# EAGLE board AnodV2.1 (EAGLE 5.11), part 1 of 3
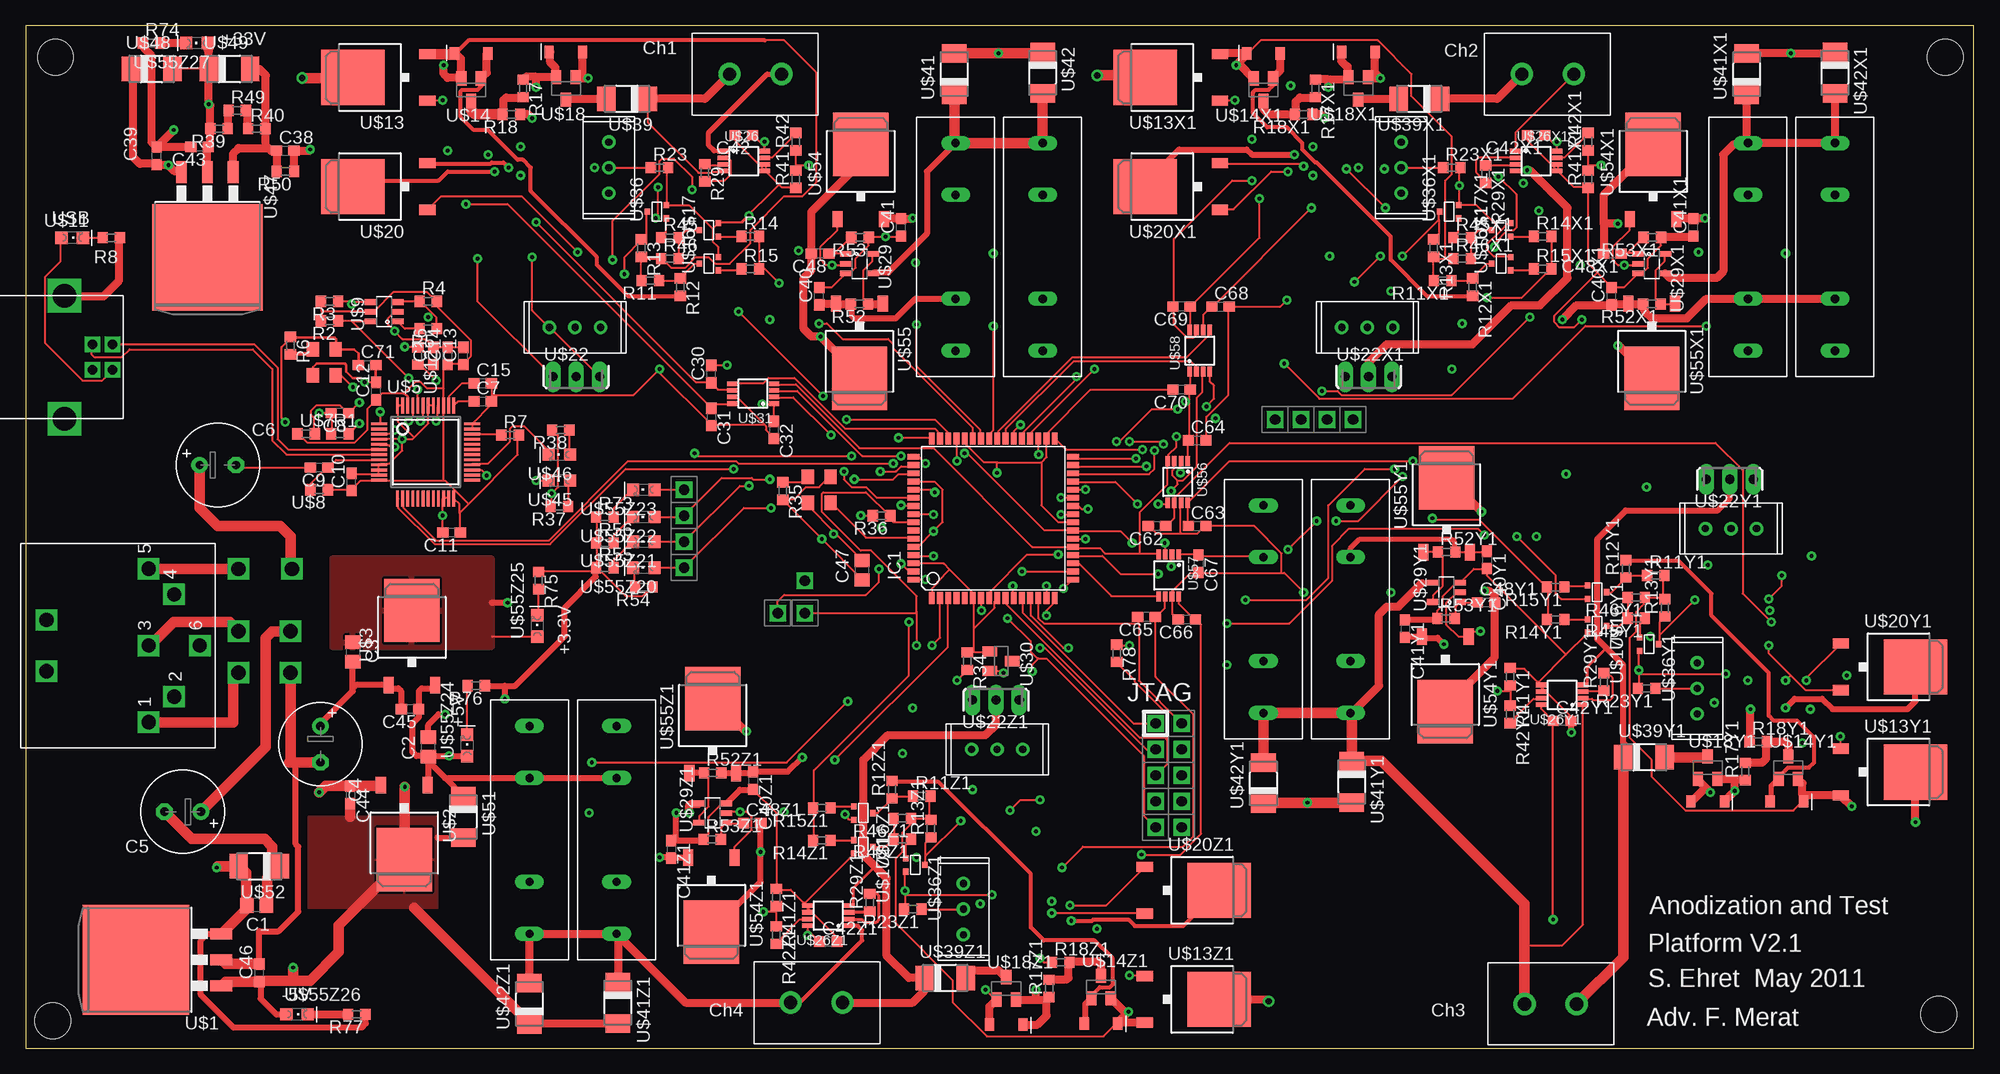
[diagram p6: board, top side]
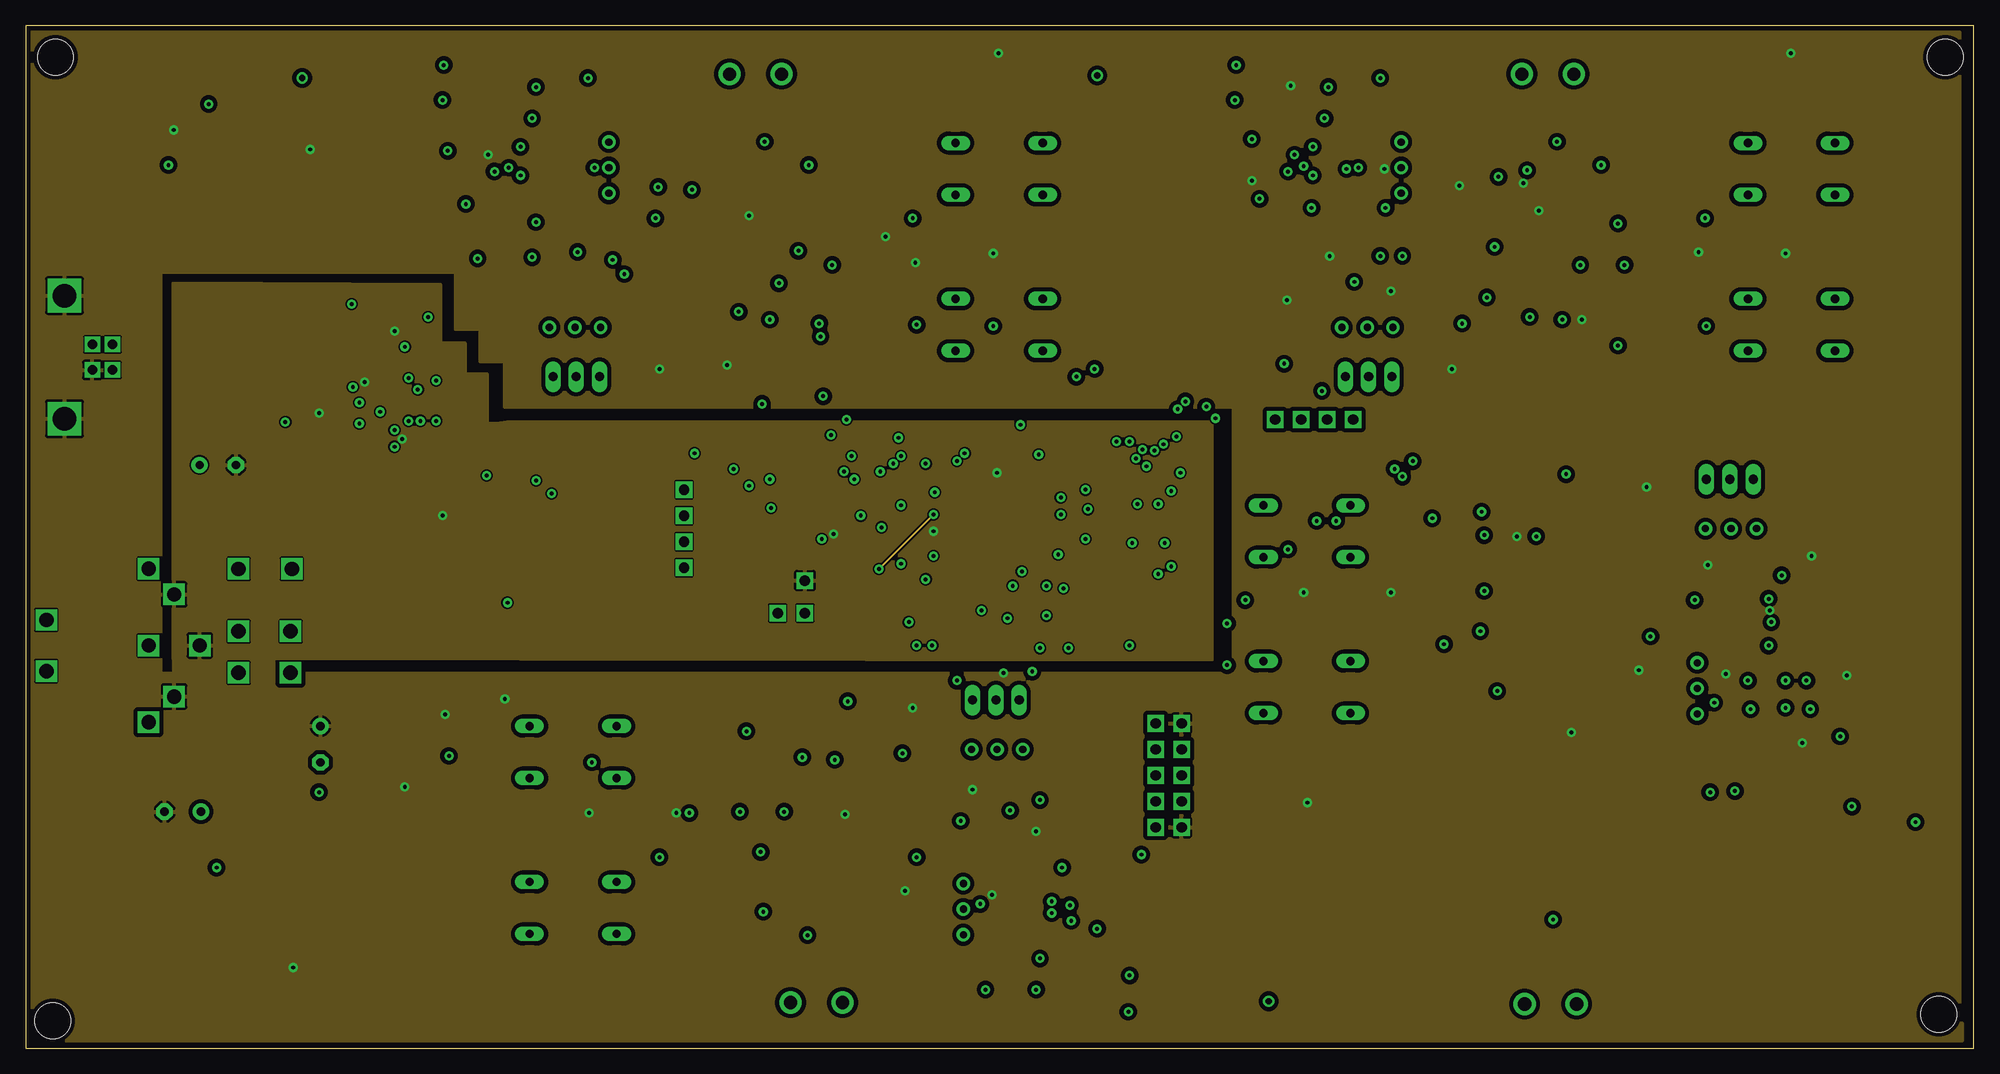
[diagram p7: board, inner layer Route2]
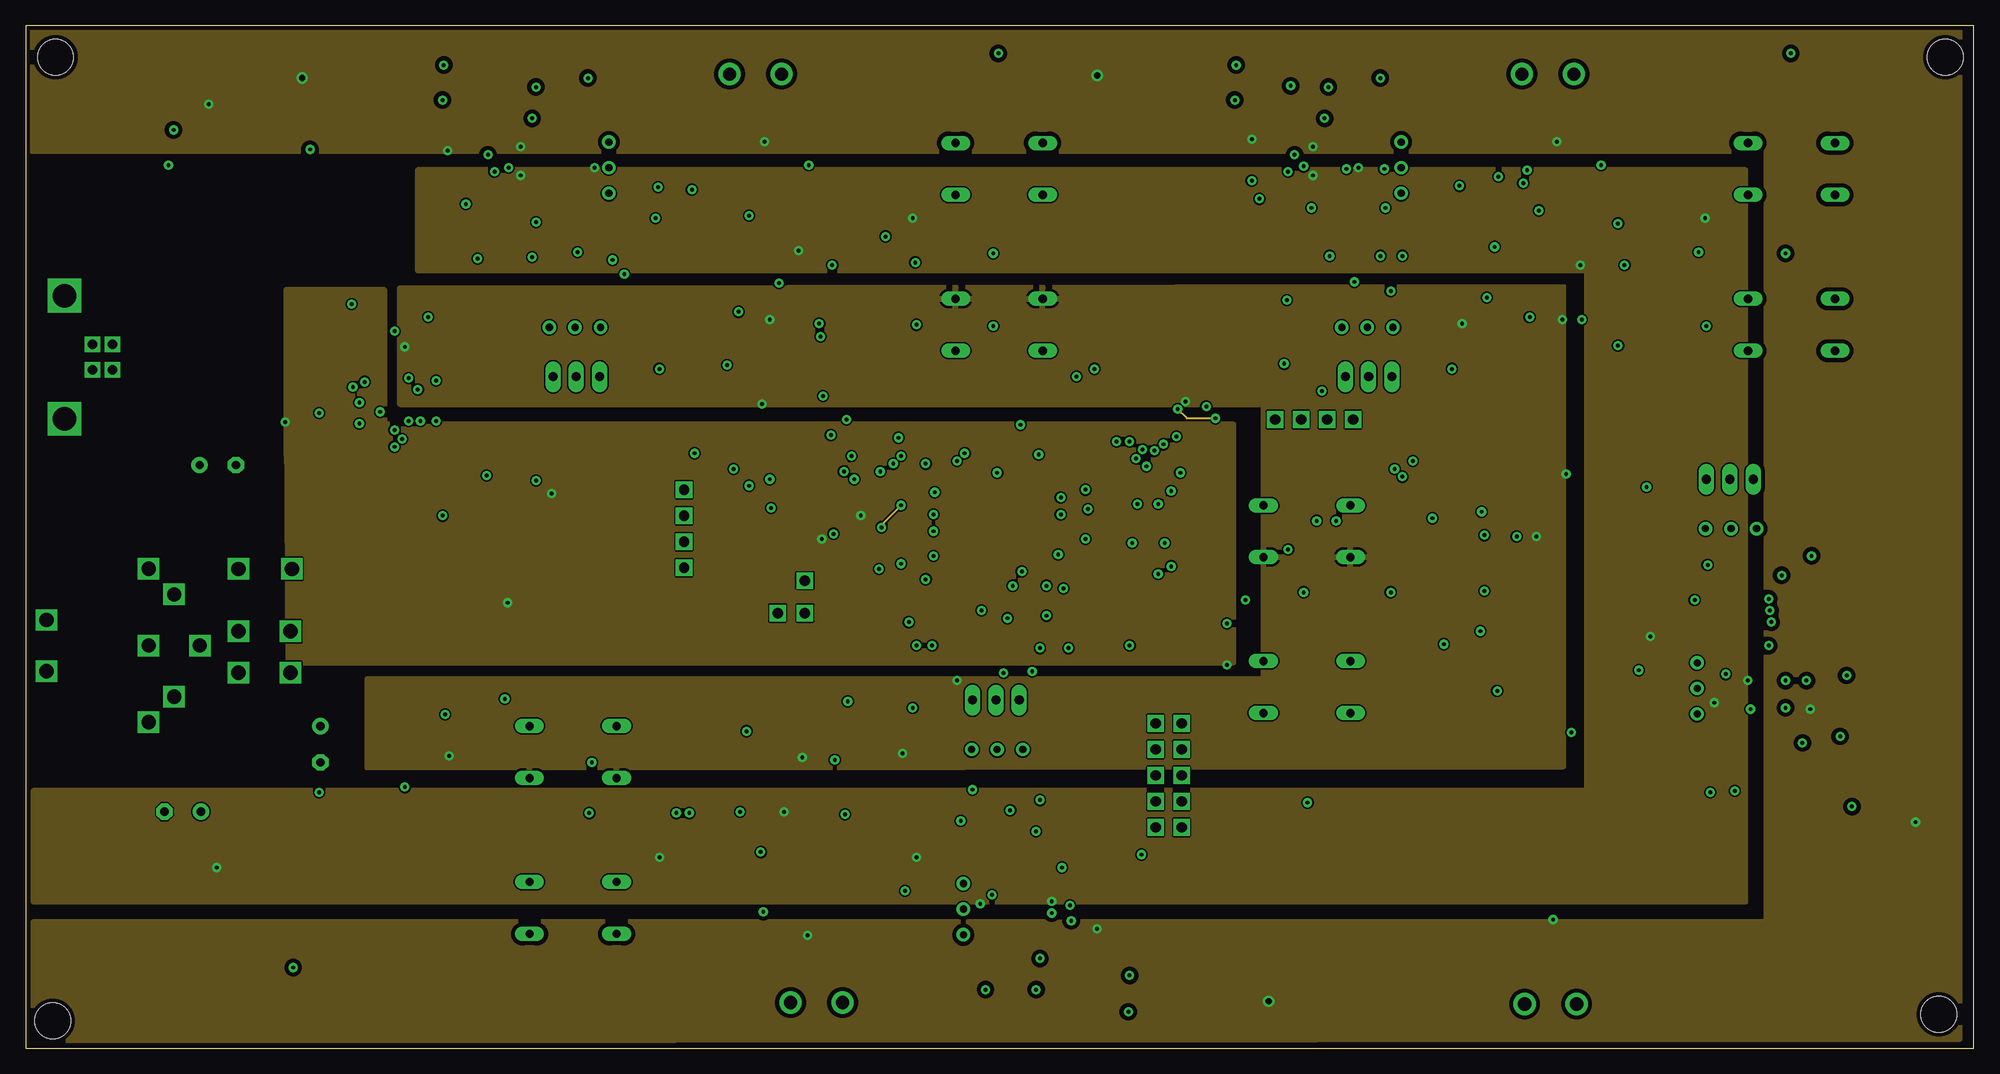
[diagram p8: board, inner layer Route15]
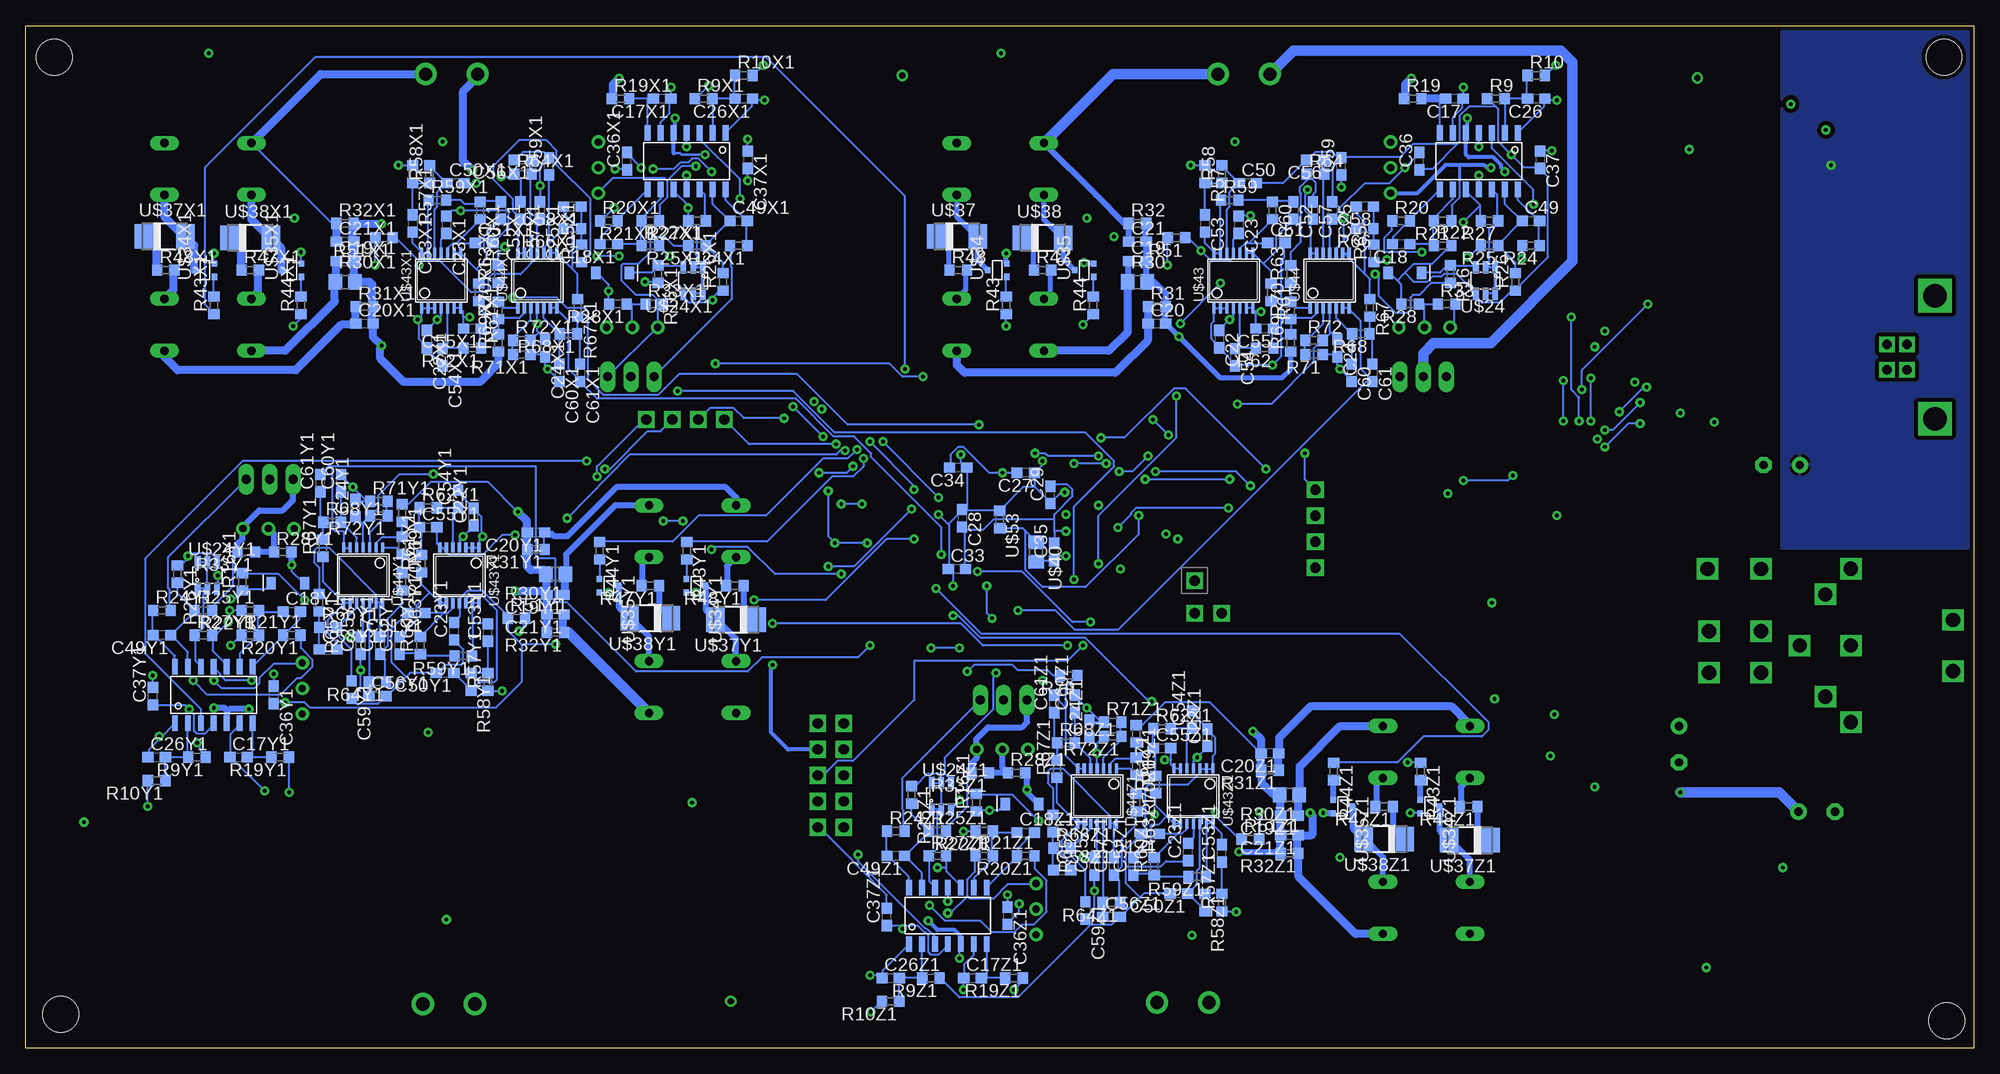
[diagram p9: board, bottom side, seen from below]

Size 190.5 x 100 mm. Coordinates in mm from the lower left corner, seen from the top.
Outline: 0,0 190.5,0 190.5,100 0,100 0,0
Copper layers (1*2+15*16): Top 0.035mm / dielectric 1.5mm / Route2 0.035mm / dielectric 0.15mm / Route15 0.035mm / dielectric 0.2mm / Bottom 0.035mm
Design rules "AdvancedCircuits_4Layer *": minimum track width 7mil, minimum drill 15mil, track to track 6mil, track to pad 6mil, pad to pad 6mil, via to via 6mil, smd to smd 6mil, copper to edge 10mil, drill to drill 8mil, minimum pad ring 12mil, minimum via ring 10mil, stop-mask expansion 4mil, vias tented up to drill 14mil, thermal gap 10mil
Holes 3.51 mm at 2.67,2.67 2.92,96.9 187.71,96.9 187.07,3.3

## Footprints (pad centres in the part's own frame; a part is rotated, then mirrored left to right if it is on the bottom)
C0805 = smd 1.3 x 1.5: 1 -0.95,0; 2 0.95,0
E3,5-8 = drill 0.813 pad 1.6 round: + -1.778,0 | drill 0.813 pad 1.6 octagon: - 1.778,0
C0603 = smd 1.1 x 1: 1 -0.85,0; 2 0.85,0
TQFP64 = smd 1.194 x 0.559: 1 -7.8,6; 2 -7.8,5.2; 3 -7.8,4.4; 4 -7.8,3.6; 5 -7.8,2.8; 6 -7.8,2; 7 -7.8,1.2; 8 -7.8,0.4; 9 -7.8,-0.4; 10 -7.8,-1.2; 11 -7.8,-2; 12 -7.8,-2.8; 13 -7.8,-3.6; 14 -7.8,-4.4; 15 -7.8,-5.2; 16 -7.8,-6; 33 7.8,-6; 34 7.8,-5.2; 35 7.8,-4.4; 36 7.8,-3.6; 37 7.8,-2.8; 38 7.8,-2; 39 7.8,-1.2; 40 7.8,-0.4; 41 7.8,0.4; 42 7.8,1.2; 43 7.8,2; 44 7.8,2.8; 45 7.8,3.6; 46 7.8,4.4; 47 7.8,5.2; 48 7.8,6 | smd 0.559 x 1.194: 17 -6,-7.8; 18 -5.2,-7.8; 19 -4.4,-7.8; 20 -3.6,-7.8; 21 -2.8,-7.8; 22 -2,-7.8; 23 -1.2,-7.8; 24 -0.4,-7.8; 25 0.4,-7.8; 26 1.2,-7.8; 27 2,-7.8; 28 2.8,-7.8; 29 3.6,-7.8; 30 4.4,-7.8; 31 5.2,-7.8; 32 6,-7.8; 49 6,7.8; 50 5.2,7.8; 51 4.4,7.8; 52 3.6,7.8; 53 2.8,7.8; 54 2,7.8; 55 1.2,7.8; 56 0.4,7.8; 57 -0.4,7.8; 58 -1.2,7.8; 59 -2,7.8; 60 -2.8,7.8; 61 -3.6,7.8; 62 -4.4,7.8; 63 -5.2,7.8; 64 -6,7.8
R0603 = smd 1 x 1.1: 1 -0.85,0; 2 0.85,0
R0805 = smd 1.3 x 1.5: 1 -0.95,0; 2 0.95,0
TO263 = smd 1.067 x 2.159: 1 -2.54,-8.331; 2 0,-8.331; 3 2.54,-8.331 | smd 10.8 x 10.41: TAB 0,0
TO252 = smd 1 x 1.6: 1 -2.48,-6.03; 3 2.08,-6.03 | smd 5.4 x 6.2: 4 -0.2,1.27
SOIC-14_CUSTOM = smd 1.52 x 0.58: 1 -2.76,3.81; 2 -2.76,2.54; 3 -2.76,1.27; 4 -2.76,0; 5 -2.76,-1.27; 6 -2.76,-2.54; 7 -2.76,-3.81; 8 2.76,-3.81; 9 2.76,-2.54; 10 2.76,-1.27; 11 2.76,0; 12 2.76,1.27; 13 2.76,2.54; 14 2.76,3.81
LQFP-48 = smd 1.6 x 0.27: 1 -4.55,2.75; 2 -4.55,2.25; 3 -4.55,1.75; 4 -4.55,1.25; 5 -4.55,0.75; 6 -4.55,0.25; 7 -4.55,-0.25; 8 -4.55,-0.75; 9 -4.55,-1.25; 10 -4.55,-1.75; 11 -4.55,-2.25; 12 -4.55,-2.75; 25 4.55,-2.75; 26 4.55,-2.25; 27 4.55,-1.75; 28 4.55,-1.25; 29 4.55,-0.75; 30 4.55,-0.25; 31 4.55,0.25; 32 4.55,0.75; 33 4.55,1.25; 34 4.55,1.75; 35 4.55,2.25; 36 4.55,2.75 | smd 0.27 x 1.6: 13 -2.75,-4.55; 14 -2.25,-4.55; 15 -1.75,-4.55; 16 -1.25,-4.55; 17 -0.75,-4.55; 18 -0.25,-4.55; 19 0.25,-4.55; 20 0.75,-4.55; 21 1.25,-4.55; 22 1.75,-4.55; 23 2.25,-4.55; 24 2.75,-4.55; 37 2.75,4.55; 38 2.25,4.55; 39 1.75,4.55; 40 1.25,4.55; 41 0.75,4.55; 42 0.25,4.55; 43 -0.25,4.55; 44 -0.75,4.55; 45 -1.25,4.55; 46 -1.75,4.55; 47 -2.25,4.55; 48 -2.75,4.55
OSC = smd 1.397 x 1.194: 1 -1.27,-1.105; 2 1.27,-1.105; 3 1.27,1.105; 4 -1.27,1.105
0603 = smd 1 x 1.1: 1 -0.85,0; 2 0.85,0
SOT23-6 = smd 0.55 x 1.2: 1 -0.95,-1.3; 2 0,-1.3; 3 0.95,-1.3; 4 0.95,1.3; 5 -0.95,1.3; 6 0.003,1.3
USB_B = drill 0.914 square: 1 1.245,4.699; 2 -1.245,4.699; 3 -1.245,2.718; 4 1.245,2.718 | drill 2.286 square: SHIELD1 -6.02,0; SHIELD2 6.02,0
CHIPLED_0805 = smd 1.2 x 1.2: A 0,-1.05; C 0,1.05
SOT23 = smd 1 x 1.4: 1 0,1.1; 2 0.95,-1.1; 3 -0.95,-1.1
SOD123 = smd 0.914 x 1.219: A 1.638,0; C -1.638,0
SOT323-R = smd 0.6 x 0.55: 1 -0.65,-0.925; 2 0.65,-0.925; 3 0,0.925
POT = drill 0.7 round: P$1 -2.5,0; P$2 0,0; P$3 2.5,0
TO251AA-V = drill 0.889 long: 1 -2.286,0; 2 0,0; 3 2.286,0
SOT23-6L = smd 0.55 x 1.2: 1 -0.95,-1.3; 2 0,-1.3; 3 0.95,-1.3; 4 0.95,1.3; 5 0,1.3; 6 -0.95,1.3
PLUG_TERM5.08 = drill 1.3 pad 2.184 round: 1 -2.54,0; 2 2.54,0
MSOP8 = smd 0.45 x 1: 1 -0.975,-2.05; 2 -0.325,-2.05; 3 0.325,-2.05; 4 0.975,-2.05; 5 0.975,2.05; 6 0.325,2.05; 7 -0.325,2.05; 8 -0.975,2.05
RELAY = drill 0.813 long: 1 -10.16,0; 2 -5.08,0; 3 5.08,0; 4 10.16,0
SOT23-5 = smd 0.55 x 1.2: 1 -0.95,-1.3; 2 0,-1.3; 3 0.95,-1.3; 4 0.95,1.3; 5 -0.95,1.3
DO-214AC = smd 1.8 x 2.4: A 2.025,0; C -2.025,0
0805 = smd 1.3 x 1.5: 1 -0.95,0; 2 0.95,0
TSSOP14 = smd 0.305 x 0.991: 1 -1.905,-2.718; 2 -1.27,-2.718; 3 -0.635,-2.718; 4 0,-2.718; 5 0.635,-2.718; 6 1.27,-2.718; 7 1.905,-2.718; 8 1.905,2.718; 9 1.27,2.718; 10 0.635,2.718; 11 0,2.718; 12 -0.635,2.718; 13 -1.27,2.718; 14 -1.905,2.718
DIN6 = drill 1.4 square: 1 7.5,10; 2 5,12.5; 3 0,10; 4 -5,12.5; 5 -7.5,10; 6 0,15; P$1 -2.5,0; P$2 2.5,0
PIN_.100 = drill 1.016 square: 2 0,0

## Placement (x,y rotation side)
C1  10u Tant  [C0805]  22.61,13.97 180 top
C2  10u  [C0805]  39.37,29.46 90 top
C3  10u Tant  [C0805]  32,38.73 270 top
C4  100u  [E3,5-8]  28.83,29.72 270 top
C5  100u  [E3,5-8]  15.37,23.11 180 top
C6  100u  [E3,5-8]  18.8,57.02 0 top
C7  .1u  [C0603]  44.7,63.25 0 top
C8  .1u  [C0603]  30.73,62.1 180 top
C9  .1u  [C0603]  28.7,56.77 180 top
C10  .1u  [C0603]  31.88,55.37 90 top
C11  .1u  [C0603]  41.66,50.42 180 top
C12  .1u  [C0603]  34.29,64.26 90 top
C13  .1u  [C0603]  42.8,67.69 90 top
C14  3.3u  [C0603]  41.27,67.69 90 top
C15  .1u  [C0603]  44.7,65.02 0 top
C16  .1u  [C0603]  39.88,67.69 90 top
C17  1000p  [C0603]  50.8,92.84 180 bottom
C17X1  1000p  [C0603]  128.27,92.84 180 bottom
C17Y1  1000p  [C0603]  169.67,28.45 0 bottom
C17Z1  1000p  [C0603]  97.92,6.86 0 bottom
C18  .001u  [C0603]  56.01,78.61 180 bottom
C18X1  .001u  [C0603]  133.48,78.61 180 bottom
C18Y1  .001u  [C0603]  164.46,42.67 0 bottom
C18Z1  .001u  [C0603]  92.71,21.08 0 bottom
C19  .01u  [C0603]  81.79,76.96 0 bottom
C19X1  .01u  [C0603]  159.26,76.96 0 bottom
C19Y1  .01u  [C0603]  138.68,44.32 180 bottom
C19Z1  .01u  [C0603]  66.93,22.73 180 bottom
C20  .001u  [C0603]  79.88,70.87 0 bottom
C20X1  .001u  [C0603]  157.35,70.87 0 bottom
C20Y1  .001u  [C0603]  140.59,50.42 180 bottom
C20Z1  .001u  [C0603]  68.83,28.83 180 bottom
C21  .33u  [C0603]  81.79,78.87 0 bottom
C21X1  .33u  [C0603]  159.26,78.87 0 bottom
C21Y1  .33u  [C0603]  138.68,42.42 180 bottom
C21Z1  .33u  [C0603]  66.93,20.83 180 bottom
C22  .1u  [C0603]  73.79,69.34 270 bottom
C22X1  .1u  [C0603]  151.26,69.34 270 bottom
C22Y1  .1u  [C0603]  146.69,51.94 90 bottom
C22Z1  .1u  [C0603]  74.93,30.35 90 bottom
C23  .1u  [C0603]  71.88,80.52 270 bottom
C23X1  .1u  [C0603]  149.35,80.52 270 bottom
C23Y1  .1u  [C0603]  148.59,40.77 90 bottom
C23Z1  .1u  [C0603]  76.83,19.18 90 bottom
C24  .1u  [C0603]  62.23,68.45 270 bottom
C24X1  .1u  [C0603]  139.7,68.45 270 bottom
C24Y1  .1u  [C0603]  158.24,52.83 90 bottom
C24Z1  .1u  [C0603]  86.49,31.24 90 bottom
C25  .1u  [C0603]  62.74,81.92 270 bottom
C25X1  .1u  [C0603]  140.21,81.92 270 bottom
C25Y1  .1u  [C0603]  157.73,39.37 90 bottom
C25Z1  .1u  [C0603]  85.98,17.78 90 bottom
C26  .001u  [C0603]  42.8,92.84 180 bottom
C26X1  .001u  [C0603]  120.27,92.84 180 bottom
C26Y1  .001u  [C0603]  177.67,28.45 0 bottom
C26Z1  .001u  [C0603]  105.92,6.86 0 bottom
C27  .1u  [C0603]  92.71,56.26 180 bottom
C28  .1u  [C0603]  98.93,51.82 270 bottom
C29  .1u  [C0603]  90.3,54.1 90 bottom
C30  .1u  [C0603]  67.06,65.91 90 top
C31  .1u  [C0603]  67.06,61.72 270 top
C32  .1u  [C0603]  73.15,60.45 270 top
C33  .1u  [C0603]  99.44,46.86 0 bottom
C34  .1u  [C0603]  99.31,56.77 180 bottom
C35  .1u  [C0603]  89.92,48.51 90 bottom
C36  1u  [C0603]  54.23,86.74 90 bottom
C36X1  1u  [C0603]  131.7,86.74 90 bottom
C36Y1  1u  [C0603]  166.24,34.54 270 bottom
C36Z1  1u  [C0603]  94.49,12.95 270 bottom
C37  1u  [C0603]  42.42,86.87 270 bottom
C37X1  1u  [C0603]  119.89,86.87 270 bottom
C37Y1  1u  [C0603]  178.05,34.42 90 bottom
C37Z1  1u  [C0603]  106.3,12.83 90 bottom
C38  3.3u  [C0603]  25.4,87.76 0 top
C39  1u  [C0603]  12.83,87.25 90 top
C40  1u  [C0603]  77.6,73.53 90 top
C40X1  1u  [C0603]  155.07,73.53 90 top
C40Y1  1u  [C0603]  142.88,47.75 270 top
C40Z1  1u  [C0603]  71.12,26.16 270 top
C41  1u  [C0603]  85.6,80.26 90 top
C41X1  1u  [C0603]  163.07,80.26 90 top
C41Y1  1u  [C0603]  134.87,41.02 270 top
C41Z1  1u  [C0603]  63.12,19.43 270 top
C42  .1u  [C0603]  70.23,89.28 180 top
C42X1  .1u  [C0603]  147.7,89.28 180 top
C42Y1  .1u  [C0603]  150.24,32 0 top
C42Z1  .1u  [C0603]  78.49,10.41 0 top
C43  1u  [C0603]  17.02,88.14 180 top
C44  1u  [C0603]  31.75,24.77 270 top
C45  10u  [C0603]  37.59,33.15 180 top
C46  1u  [C0603]  22.86,7.37 90 top
C47  10u  [C0805]  81.79,46.74 90 top
C48  .01u  [C0603]  77.67,77.7 180 top
C48X1  .01u  [C0603]  155.14,77.7 180 top
C48Y1  .01u  [C0603]  142.8,43.59 0 top
C48Z1  .01u  [C0603]  71.04,22 0 top
C49  .001u  [C0603]  43.31,80.9 0 bottom
C49X1  .001u  [C0603]  120.78,80.9 0 bottom
C49Y1  .001u  [C0603]  177.16,40.39 180 bottom
C49Z1  .001u  [C0603]  105.41,18.8 180 bottom
C50  .001u  [C0603]  70.99,84.58 0 bottom
C50X1  .001u  [C0603]  148.46,84.58 0 bottom
C50Y1  .001u  [C0603]  149.48,36.7 180 bottom
C50Z1  .001u  [C0603]  77.72,15.11 180 bottom
C51  .001u  [C0603]  68.2,78.74 0 bottom
C51X1  .001u  [C0603]  145.67,78.74 0 bottom
C51Y1  .001u  [C0603]  152.27,42.55 180 bottom
C51Z1  .001u  [C0603]  80.52,20.95 180 bottom
C52  .0022u  [C0603]  66.55,81.92 270 bottom
C52X1  .0022u  [C0603]  144.02,81.92 270 bottom
C52Y1  .0022u  [C0603]  153.92,39.37 90 bottom
C52Z1  .0022u  [C0603]  82.17,17.78 90 bottom
C53  .0012u  [C0603]  75.18,80.64 270 bottom
C53X1  .0012u  [C0603]  152.65,80.64 270 bottom
C53Y1  .0012u  [C0603]  145.29,40.64 90 bottom
C53Z1  .0012u  [C0603]  73.53,19.05 90 bottom
C54  .001u  [C0603]  72.26,67.56 270 bottom
C54X1  .001u  [C0603]  149.73,67.56 270 bottom
C54Y1  .001u  [C0603]  148.21,53.72 90 bottom
C54Z1  .001u  [C0603]  76.45,32.13 90 bottom
C55  0.015u  [C0603]  69.34,70.36 180 bottom
C55X1  .015u  [C0603]  146.81,70.36 180 bottom
C55Y1  .015u  [C0603]  151.13,50.93 0 bottom
C55Z1  .015u  [C0603]  79.38,29.34 0 bottom
C56  .001u  [C0603]  64.39,86.87 180 bottom
C56X1  .001u  [C0603]  141.86,86.87 180 bottom
C56Y1  .001u  [C0603]  156.08,34.42 0 bottom
C56Z1  .001u  [C0603]  84.33,12.83 0 bottom
C57  .0012u  [C0603]  64.64,81.92 270 bottom
C57X1  .0012u  [C0603]  142.11,81.92 270 bottom
C57Y1  .0012u  [C0603]  155.83,39.37 90 bottom
C57Z1  .0012u  [C0603]  84.07,17.78 90 bottom
C58  .0022u  [C0603]  59.56,82.3 180 bottom
C58X1  .0022u  [C0603]  137.03,82.3 180 bottom
C58Y1  .0022u  [C0603]  160.91,38.99 0 bottom
C58Z1  .0022u  [C0603]  89.15,17.4 0 bottom
C59  .001u  [C0603]  61.85,86.23 90 bottom
C59X1  .001u  [C0603]  139.32,86.23 90 bottom
C59Y1  .001u  [C0603]  158.62,35.05 270 bottom
C59Z1  .001u  [C0603]  86.87,13.46 270 bottom
C60  .001u  [C0603]  60.83,66.04 270 bottom
C60X1  .001u  [C0603]  138.3,66.04 270 bottom
C60Y1  .001u  [C0603]  159.64,55.24 90 bottom
C60Z1  .001u  [C0603]  87.88,33.66 90 bottom
C61  .015u  [C0603]  58.8,66.04 270 bottom
C61X1  .015u  [C0603]  136.27,66.04 270 bottom
C61Y1  .015u  [C0603]  161.67,55.24 90 bottom
C61Z1  .015u  [C0603]  89.92,33.66 90 bottom
C62  .1u  [C0603]  110.62,51.05 180 top
C63  .1u  [C0603]  114.55,51.05 0 top
C64  .1u  [C0603]  114.55,59.44 0 top
C65  .1u  [C0603]  109.6,42.16 180 top
C66  .1u  [C0603]  113.54,41.91 180 top
C67  .1u  [C0603]  114.68,47.37 270 top
C68  .1u  [C0603]  116.84,72.52 0 top
C69  .1u  [C0603]  113.03,72.52 180 top
C70  .1u  [C0603]  113.03,64.39 180 top
C71  .1u  [C0603]  33.4,66.8 0 top
IC1  AVR_XMEGA_A3_  [TQFP64]  94.62,51.82 90 top
R1  12k  [R0603]  30.73,60.07 0 top
R2  10k  [R0603]  29.72,71.12 180 top
R3  10k  [R0603]  29.72,73.03 180 top
R4  10k  [R0603]  39.37,73.03 0 top
R5  2k  [R0603]  39.37,70.36 180 top
R6  10k  [R0603]  25.91,68.71 270 top
R7  10k  [R0603]  47.37,59.94 0 top
R8  330  [R0603]  8.38,79.25 180 top
R9  2k  [R0603]  46.74,92.84 0 bottom
R9X1  2k  [R0603]  124.21,92.84 0 bottom
R9Y1  2k  [R0603]  173.74,28.45 180 bottom
R9Z1  2k  [R0603]  101.98,6.86 180 bottom
R10  14k  [R0603]  42.8,95.12 0 bottom
R10X1  14k  [R0603]  120.27,95.12 0 bottom
R10Y1  14k  [R0603]  177.67,26.16 180 bottom
R10Z1  14k  [R0603]  105.92,4.57 180 bottom
R11  10k  [R0603]  61.09,75.06 180 top
R11X1  10k  [R0603]  138.56,75.06 180 top
R11Y1  10k  [R0603]  159.38,46.23 0 top
R11Z1  10k  [R0603]  87.63,24.64 0 top
R12  1k  [R0603]  64.01,74.42 270 top
R12X1  1k  [R0603]  141.48,74.42 270 top
R12Y1  1k  [R0603]  156.46,46.86 90 top
R12Z1  1k  [R0603]  84.71,25.27 90 top
R13  1k  [R0603]  60.2,78.23 270 top
R13X1  1k  [R0603]  137.67,78.23 270 top
R13Y1  1k  [R0603]  160.27,43.05 90 top
R13Z1  1k  [R0603]  88.52,21.46 90 top
R14  100  [R0603]  70.87,79.38 0 top
R14X1  100  [R0603]  148.34,79.38 0 top
R14Y1  100  [R0603]  149.61,41.91 180 top
R14Z1  100  [R0603]  77.85,20.32 180 top
R15  100  [R0603]  70.87,76.2 0 top
R15X1  100  [R0603]  148.34,76.2 0 top
R15Y1  100  [R0603]  149.61,45.09 180 top
R15Z1  100  [R0603]  77.85,23.5 180 top
R16  100  [R0603]  51.18,75.69 270 bottom
R16X1  100  [R0603]  128.65,75.69 270 bottom
R16Y1  100  [R0603]  169.29,45.59 90 bottom
R16Z1  100  [R0603]  97.54,24 90 bottom
R17  1  [R0603]  48.64,93.85 270 top
R17X1  1  [R0603]  126.11,93.85 270 top
R17Y1  1  [R0603]  168.15,27.05 90 top
R17Z1  1  [R0603]  100.08,5.84 90 top
R18  10  [R0603]  47.5,91.31 180 top
R18X1  10  [R0603]  124.97,91.31 180 top
R18Y1  10  [R0603]  169.42,29.97 0 top
R18Z1  10  [R0603]  101.22,8.38 0 top
R19  1k  [R0603]  54.86,92.84 0 bottom
R19X1  1k  [R0603]  132.33,92.84 0 bottom
R19Y1  1k  [R0603]  165.61,28.45 180 bottom
R19Z1  1k  [R0603]  93.85,6.86 180 bottom
R20  100  [R0603]  56.01,80.9 0 bottom
R20X1  100  [R0603]  133.48,80.9 0 bottom
R20Y1  100  [R0603]  164.46,40.39 180 bottom
R20Z1  100  [R0603]  92.71,18.8 180 bottom
R21  10k  [R0603]  51.94,80.9 180 bottom
R21X1  10k  [R0603]  129.41,80.9 180 bottom
R21Y1  10k  [R0603]  168.53,40.39 0 bottom
R21Z1  10k  [R0603]  96.77,18.8 0 bottom
R22  DNP  [R0603]  51.94,78.49 0 bottom
R22X1  DNP  [R0603]  129.41,78.49 0 bottom
R22Y1  DNP  [R0603]  168.53,42.8 180 bottom
R22Z1  DNP  [R0603]  96.77,21.21 180 bottom
R23  35.7  [R0603]  61.98,86.11 0 top
R23X1  35.7  [R0603]  139.45,86.11 0 top
R23Y1  35.7  [R0603]  158.5,35.18 180 top
R23Z1  35.7  [R0603]  86.74,13.59 180 top
R24  100  [R0603]  43.31,78.49 180 bottom
R24X1  100  [R0603]  120.78,78.49 180 bottom
R24Y1  100  [R0603]  177.16,42.8 0 bottom
R24Z1  100  [R0603]  105.41,21.21 0 bottom
R25  10k  [R0603]  47.37,78.49 180 bottom
R25X1  10k  [R0603]  124.84,78.49 180 bottom
R25Y1  10k  [R0603]  173.1,42.8 0 bottom
R25Z1  10k  [R0603]  101.35,21.21 0 bottom
R26  DNP  [R0603]  44.83,74.93 90 bottom
R26X1  DNP  [R0603]  122.3,74.93 90 bottom
R26Y1  DNP  [R0603]  175.64,46.35 270 bottom
R26Z1  DNP  [R0603]  103.89,24.77 270 bottom
R27  100k  [R0603]  47.37,80.9 180 bottom
R27X1  100k  [R0603]  124.84,80.9 180 bottom
R27Y1  100k  [R0603]  173.1,40.39 0 bottom
R27Z1  100k  [R0603]  101.35,18.8 0 bottom
R28  3.57  [R0603]  55.12,72.77 180 bottom
R28X1  3.57  [R0603]  132.59,72.77 180 bottom
R28Y1  3.57  [R0603]  165.35,48.51 0 bottom
R28Z1  3.57  [R0603]  93.6,26.92 0 bottom
R29  DNP  [R0603]  66.42,85.6 270 top
R29X1  DNP  [R0603]  142.75,85.47 270 top
R29Y1  DNP  [R0603]  154.3,35.81 90 top
R29Z1  DNP  [R0603]  82.55,14.22 90 top
R30  1  [R0805]  81.79,74.93 0 bottom
R30X1  1  [R0805]  159.26,74.93 0 bottom
R30Y1  .1  [R0805]  138.68,46.35 180 bottom
R30Z1  1  [R0805]  66.93,24.77 180 bottom
R31  1k  [R0603]  79.88,72.52 0 bottom
R31X1  1k  [R0603]  157.35,72.52 0 bottom
R31Y1  1k  [R0603]  140.59,48.77 180 bottom
R31Z1  1000  [R0603]  68.83,27.18 180 bottom
R32  1Meg  [R0603]  81.79,80.64 0 bottom
R32X1  1Meg  [R0603]  159.26,80.64 0 bottom
R32Y1  1Meg  [R0603]  138.68,40.64 180 bottom
R32Z1  1Meg  [R0603]  66.93,19.05 180 bottom
R33  1  [R0603]  51.56,72.77 0 bottom
R33X1  1  [R0603]  129.03,72.77 0 bottom
R33Y1  1  [R0603]  168.91,48.51 180 bottom
R33Z1  1  [R0603]  97.16,26.92 180 bottom
R34  3.57k  [R0603]  92.08,37.85 270 top
R35  10k  [R0603]  74.04,54.48 270 top
R36  10k  [R0603]  83.69,52.07 180 top
R37  330  [R0603]  52.2,52.96 180 top
R38  330  [R0603]  52.32,60.45 180 top
R39  100  [R0603]  18.92,89.92 180 top
R40  3.57  [R0603]  22.61,89.92 0 top
R41  330  [R0603]  75.31,84.96 90 top
R41X1  330  [R0603]  152.78,84.96 90 top
R41Y1  330  [R0603]  145.16,36.32 270 top
R41Z1  330  [R0603]  73.41,14.73 270 top
R42  3.83k  [R0603]  75.31,88.65 90 top
R42X1  3.83k  [R0603]  152.78,88.65 90 top
R42Y1  3.83k  [R0603]  145.16,32.64 270 top
R42Z1  3.83k  [R0603]  73.41,11.05 270 top
R43  100  [R0603]  94.62,72.64 90 bottom
R43X1  100  [R0603]  172.08,72.64 90 bottom
R43Y1  100  [R0603]  125.86,48.64 270 bottom
R43Z1  100  [R0603]  54.1,27.05 270 bottom
R44  100  [R0603]  86.11,72.64 90 bottom
R44X1  100  [R0603]  163.58,72.64 90 bottom
R44Y1  100  [R0603]  134.37,48.64 270 bottom
R44Z1  100  [R0603]  62.61,27.05 270 bottom
R45  10k  [R0603]  62.99,79.25 0 top
R45X1  10k  [R0603]  140.46,79.25 0 top
R45Y1  10k  [R0603]  157.48,42.04 180 top
R45Z1  10k  [R0603]  85.73,20.45 180 top
R46  10k  [R0603]  62.99,77.22 0 top
R46X1  10k  [R0603]  140.46,77.22 0 top
R46Y1  10k  [R0603]  157.48,44.07 180 top
R46Z1  10k  [R0603]  85.73,22.48 180 top
R47  100  [R0603]  91.06,76.07 0 bottom
R47X1  100  [R0603]  168.53,76.07 0 bottom
R47Y1  100  [R0603]  129.41,45.21 180 bottom
R47Z1  100  [R0603]  57.66,23.62 180 bottom
R48  100  [R0603]  99.31,76.07 0 bottom
R48X1  100  [R0603]  176.78,76.07 0 bottom
R48Y1  100  [R0603]  121.16,45.21 180 bottom
R48Z1  100  [R0603]  49.4,23.62 180 bottom
R49  10  [R0603]  20.7,91.69 0 top
R50  2940  [R0603]  25.4,85.72 180 top
R51  470  [R0603]  77.98,79.25 180 bottom
R51X1  470  [R0603]  155.45,79.25 180 bottom
R51Y1  470  [R0603]  142.49,42.04 0 bottom
R51Z1  470  [R0603]  70.74,20.45 0 bottom
R52  470  [R0603]  81.53,72.77 180 top
R52X1  470  [R0603]  159,72.77 180 top
R52Y1  470  [R0603]  138.94,48.51 0 top
R52Z1  470  [R0603]  67.18,26.92 0 top
R53  250  [R0603]  81.58,79.27 180 top
R53X1  250  [R0603]  159.05,79.27 180 top
R53Y1  250  [R0603]  138.89,42.01 0 top
R53Z1  250  [R0603]  67.13,20.42 0 top
R54  330  [R0603]  60.45,45.09 180 top
R55  330  [R0603]  56.64,46.99 0 top
R56  330  [R0603]  56.64,49.4 0 top
R57  10.2k  [R0603]  75.18,85.47 270 bottom
R57X1  10.2k  [R0603]  152.65,85.47 270 bottom
R57Y1  10.2k  [R0603]  145.29,35.81 90 bottom
R57Z1  10.2k  [R0603]  73.53,14.22 90 bottom
R58  20.5k  [R0603]  73.53,85.47 90 bottom
R58X1  20.5k  [R0603]  151,85.47 90 bottom
R58Y1  20.5k  [R0603]  146.94,35.81 270 bottom
R58Z1  20.5k  [R0603]  75.18,14.22 270 bottom
R59  7.87k  [R0603]  72.77,82.93 0 bottom
R59X1  7.87k  [R0603]  150.24,82.93 0 bottom
R59Y1  7.87k  [R0603]  147.7,38.35 180 bottom
R59Z1  7.87k  [R0603]  75.95,16.76 180 bottom
R60  14.7k  [R0603]  68.58,81.92 270 bottom
R60X1  14.7k  [R0603]  146.05,81.92 270 bottom
R60Y1  14.7k  [R0603]  151.89,39.37 90 bottom
R60Z1  14.7k  [R0603]  80.14,17.78 90 bottom
R61  3.83k  [R0603]  68.71,73.91 270 bottom
R61X1  3.83k  [R0603]  146.18,73.91 270 bottom
R61Y1  3.83k  [R0603]  151.76,47.37 90 bottom
R61Z1  3.83k  [R0603]  80.01,25.78 90 bottom
R62  4.42k  [R0603]  69.34,68.45 180 bottom
R62X1  4.42k  [R0603]  146.81,68.45 180 bottom
R62Y1  4.42k  [R0603]  151.13,52.83 0 bottom
R62Z1  4.42k  [R0603]  79.38,31.24 0 bottom
R63  10.2k  [R0603]  66.8,75.69 90 bottom
R63X1  10.2k  [R0603]  144.27,75.69 90 bottom
R63Y1  10.2k  [R0603]  153.67,45.59 270 bottom
R63Z1  10.2k  [R0603]  81.92,24 270 bottom
R64  20.5k  [R0603]  64.39,85.47 0 bottom
R64X1  20.5k  [R0603]  141.86,85.47 0 bottom
R64Y1  20.5k  [R0603]  156.08,35.81 180 bottom
R64Z1  20.5k  [R0603]  84.33,14.22 180 bottom
R65  7.87k  [R0603]  58.67,77.72 90 bottom
R65X1  7.87k  [R0603]  136.14,77.72 90 bottom
R65Y1  7.87k  [R0603]  161.8,43.56 270 bottom
R65Z1  7.87k  [R0603]  90.04,21.97 270 bottom
R66  14.7k  [R0603]  59.56,80.14 180 bottom
R66X1  14.7k  [R0603]  137.03,80.14 180 bottom
R66Y1  14.7k  [R0603]  160.91,41.15 0 bottom
R66Z1  14.7k  [R0603]  89.15,19.56 0 bottom
R67  3.83k  [R0603]  59.06,72.39 270 bottom
R67X1  3.83k  [R0603]  136.53,72.39 270 bottom
R67Y1  3.83k  [R0603]  161.42,48.9 90 bottom
R67Z1  3.83k  [R0603]  89.66,27.3 90 bottom
R68  4.42k  [R0603]  59.94,69.85 180 bottom
R68X1  4.42k  [R0603]  137.41,69.85 180 bottom
R68Y1  4.42k  [R0603]  160.53,51.44 0 bottom
R68Z1  4.42k  [R0603]  88.77,29.84 0 bottom
R69  2940  [R0603]  66.8,68.96 90 bottom
R69X1  2940  [R0603]  144.27,68.96 90 bottom
R69Y1  2940  [R0603]  153.67,52.32 270 bottom
R69Z1  2940  [R0603]  81.92,30.73 270 bottom
R70  3570  [R0603]  66.8,72.14 90 bottom
R70X1  3570  [R0603]  144.27,72.14 90 bottom
R70Y1  3570  [R0603]  153.67,49.15 270 bottom
R70Z1  3570  [R0603]  81.92,27.56 270 bottom
R71  442  [R0603]  64.52,67.82 180 bottom
R71X1  442  [R0603]  141.99,67.82 180 bottom
R71Y1  442  [R0603]  155.96,53.47 0 bottom
R71Z1  442  [R0603]  84.2,31.88 0 bottom
R72  3570  [R0603]  64.52,69.22 0 bottom
R72X1  3570  [R0603]  141.99,69.22 0 bottom
R72Y1  3570  [R0603]  155.96,52.07 180 bottom
R72Z1  3570  [R0603]  84.2,30.48 180 bottom
R73  330  [R0603]  56.64,51.94 0 top
R74  10k  [R0603]  12.32,98.3 0 top
R75  330  [R0603]  50.17,45.72 270 top
R76  330  [R0603]  44.07,35.43 180 top
R77  330  [R0603]  32.38,3.3 180 top
R78  10k  [R0603]  106.68,38.61 270 top
R79  10k  [R0603]  88.52,36.45 180 bottom
U$1  LM2990  [TO263]  10.79,8.64 90 top
U$2  LP38690TO  [TO252]  36.83,19.68 180 top
U$3  NCP1117_3.3_REG  [TO252]  37.97,41.53 0 top
U$4  [SOIC-14_CUSTOM]  48.39,86.74 270 bottom
U$4X1  [SOIC-14_CUSTOM]  125.86,86.74 270 bottom
U$4Y1  MC33174DG  [SOIC-14_CUSTOM]  172.08,34.54 90 bottom
U$4Z1  MC33174DG  [SOIC-14_CUSTOM]  100.33,12.95 90 bottom
U$5  FT232H  [LQFP-48]  39.12,58.29 0 top
U$6  OSCILLATOR  [OSC]  29.21,67.06 270 top
U$7  600R  [0603]  27.43,60.07 0 top
U$8  600R  [0603]  28.7,54.61 180 top
U$9  [SOT23-6]  35.05,72.01 90 top
U$10  USB_B  [USB_B]  3.81,67.56 270 top
U$11  [CHIPLED_0805]  4.57,79.25 270 top
U$12  600R  [0603]  38.35,67.69 270 top
U$13  2SD1758  [TO252]  33.27,95.12 90 top
U$13X1  2SD1758  [TO252]  110.74,95.12 90 top
U$13Y1  2SD1758  [TO252]  183.51,26.8 270 top
U$13Z1  2SD1758  [TO252]  115.44,4.57 270 top
U$14  SI2319DS  [SOT23]  43.56,93.73 180 top
U$14X1  SI2319DS  [SOT23]  121.03,93.73 180 top
U$14Y1  SI2319DS  [SOT23]  172.34,27.43 0 top
U$14Z1  SI2319DS  [SOT23]  105.16,5.97 0 top
U$15  MMSZ5245B  [SOD123]  43.56,97.28 0 top
U$15X1  MMSZ5245B  [SOD123]  121.03,97.28 0 top
U$15Y1  MMSZ5245B  [SOD123]  172.21,24.13 180 top
U$15Z1  MMSZ5245B  [SOD123]  105.16,2.41 180 top
U$16  NPN_DSS414  [SOT323-R]  66.8,76.71 90 top
U$16X1  NPN_DSS414  [SOT323-R]  144.27,76.71 90 top
U$16Y1  NPN_DSS414  [SOT323-R]  153.67,44.58 270 top
U$16Z1  NPN_DSS414  [SOT323-R]  81.92,22.99 270 top
U$17  NPN_DSS414  [SOT323-R]  66.8,80.01 90 top
U$17X1  NPN_DSS414  [SOT323-R]  144.27,80.01 90 top
U$17Y1  NPN_DSS414  [SOT323-R]  153.67,41.27 270 top
U$17Z1  NPN_DSS414  [SOT323-R]  81.92,19.68 270 top
U$18  SI2319DS  [SOT23]  52.83,93.85 180 top
U$18X1  SI2319DS  [SOT23]  130.3,93.85 180 top
U$18Y1  SI2319DS  [SOT23]  164.46,27.43 0 top
U$18Z1  SI2319DS  [SOT23]  95.89,5.84 0 top
U$19  MMSZ5245B  [SOD123]  52.83,97.41 0 top
U$19X1  MMSZ5245B  [SOD123]  130.3,97.41 0 top
U$19Y1  MMSZ5245B  [SOD123]  164.46,24.13 180 top
U$19Z1  MMSZ5245B  [SOD123]  95.89,2.29 180 top
U$20  2SD1758  [TO252]  33.27,84.45 90 top
U$20X1  2SD1758  [TO252]  110.74,84.45 90 top
U$20Y1  2SD1758  [TO252]  183.51,37.08 270 top
U$20Z1  2SD1758  [TO252]  115.44,15.24 270 top
U$21  10  [POT]  57.02,86.11 270 top
U$21X1  10  [POT]  134.49,86.11 270 top
U$21Y1  10  [POT]  163.45,35.18 90 top
U$21Z1  10  [POT]  91.69,13.59 90 top
U$22  [TO251AA-V]  53.85,65.66 0 top
U$22X1  [TO251AA-V]  131.32,65.66 0 top
U$22Y1  [TO251AA-V]  166.62,55.63 180 top
U$22Z1  [TO251AA-V]  94.87,34.04 180 top
U$23  10  [POT]  53.72,70.48 180 top
U$23X1  10  [POT]  131.19,70.48 180 top
U$23Y1  10  [POT]  166.75,50.8 0 top
U$23Z1  10  [POT]  95,29.21 0 top
U$24  [SOT23-6L]  47.75,75.06 180 bottom
U$24X1  [SOT23-6L]  125.22,75.06 180 bottom
U$24Y1  DS31187  [SOT23-6L]  172.72,46.23 0 bottom
U$24Z1  DS31187  [SOT23-6L]  100.97,24.64 0 bottom
U$25  2TERM  [PLUG_TERM5.08]  71.37,95.25 180 top
U$25X1  2TERM  [PLUG_TERM5.08]  148.84,95.25 180 top
U$25Y1  2TERM  [PLUG_TERM5.08]  149.1,4.32 0 top
U$25Z1  2TERM  [PLUG_TERM5.08]  77.34,4.45 0 top
U$26  AD8220  [MSOP8]  70.23,86.74 270 top
U$26X1  AD8220  [MSOP8]  147.7,86.74 270 top
U$26Y1  AD8220  [MSOP8]  150.24,34.54 90 top
U$26Z1  AD8220  [MSOP8]  78.49,12.95 90 top
U$27  RELAY  [RELAY]  90.93,78.36 270 top
U$27X1  RELAY  [RELAY]  168.4,78.36 270 top
U$27Y1  RELAY  [RELAY]  129.54,42.93 90 top
U$27Z1  RELAY  [RELAY]  57.78,21.34 90 top
U$28  RELAY  [RELAY]  99.44,78.36 270 top
U$28X1  RELAY  [RELAY]  176.91,78.36 270 top
U$28Y1  RELAY  [RELAY]  121.03,42.93 90 top
U$28Z1  RELAY  [RELAY]  49.28,21.34 90 top
U$29  [SOT23-5]  81.53,76.71 270 top
U$29X1  [SOT23-5]  159,76.71 270 top
U$29Y1  [SOT23-5]  138.94,44.58 90 top
U$29Z1  [SOT23-5]  67.18,22.99 90 top
U$30  1.22V  [SOT23]  95.38,37.85 270 top
U$31  [MSOP8]  71.12,64.01 90 top
U$32  OSCILLATOR  [OSC]  77.6,54.61 270 top
U$33  MMSZ5245B  [SOD123]  55.63,75.82 180 bottom
U$33X1  MMSZ5245B  [SOD123]  133.1,75.82 180 bottom
U$33Y1  MMSZ5245B  [SOD123]  164.85,45.47 0 bottom
U$33Z1  MMSZ5245B  [SOD123]  93.09,23.88 0 bottom
U$34  NPN_DSS414  [SOT323-R]  95.5,76.07 90 bottom
U$34X1  NPN_DSS414  [SOT323-R]  172.97,76.07 90 bottom
U$34Y1  NPN_DSS414  [SOT323-R]  124.97,45.21 270 bottom
U$34Z1  NPN_DSS414  [SOT323-R]  53.21,23.62 270 bottom
U$35  NPN_DSS414  [SOT323-R]  87,76.07 90 bottom
U$35X1  NPN_DSS414  [SOT323-R]  164.46,76.07 90 bottom
U$35Y1  NPN_DSS414  [SOT323-R]  133.48,45.21 270 bottom
U$35Z1  NPN_DSS414  [SOT323-R]  61.72,23.62 270 bottom
U$36  NPN_DSS414  [SOT323-R]  61.72,81.79 90 top
U$36X1  NPN_DSS414  [SOT323-R]  139.19,81.79 90 top
U$36Y1  NPN_DSS414  [SOT323-R]  158.75,39.5 270 top
U$36Z1  NPN_DSS414  [SOT323-R]  87,17.91 270 top
U$37  [DO-214AC]  99.44,79.38 0 bottom
U$37X1  ES1G-TP_DIODE'  [DO-214AC]  176.91,79.38 0 bottom
U$37Y1  ES1G-TP_DIODE'  [DO-214AC]  121.03,41.91 180 bottom
U$37Z1  ES1G-TP_DIODE'  [DO-214AC]  49.28,20.32 180 bottom
U$38  [DO-214AC]  91.06,79.25 0 bottom
U$38X1  ES1G-TP_DIODE'  [DO-214AC]  168.53,79.25 0 bottom
U$38Y1  ES1G-TP_DIODE'  [DO-214AC]  129.41,42.04 180 bottom
U$38Z1  ES1G-TP_DIODE'  [DO-214AC]  57.66,20.45 180 bottom
U$39  [DO-214AC]  58.8,92.84 180 top
U$39X1  [DO-214AC]  136.27,92.84 180 top
U$39Y1  [DO-214AC]  158.24,28.45 0 top
U$39Z1  [DO-214AC]  89.92,6.86 0 top
U$40  10u  [0805]  91.69,48.51 270 bottom
U$41  [DO-214AC]  90.81,95.25 90 top
U$41X1  [DO-214AC]  168.27,95.25 90 top
U$41Y1  [DO-214AC]  129.67,26.04 270 top
U$41Z1  [DO-214AC]  57.91,4.45 270 top
U$42  [DO-214AC]  99.44,95.38 270 top
U$42X1  [DO-214AC]  176.91,95.38 270 top
U$42Y1  [DO-214AC]  121.03,25.91 90 top
U$42Z1  [DO-214AC]  49.28,4.32 90 top
U$43  [TSSOP14]  72.39,75.06 0 bottom
U$43X1  TLC27M4  [TSSOP14]  149.86,75.06 0 bottom
U$43Y1  TLC27M4  [TSSOP14]  148.08,46.23 180 bottom
U$43Z1  TLC27M4  [TSSOP14]  76.33,24.64 180 bottom
U$44  [TSSOP14]  62.99,75.06 0 bottom
U$44X1  TLC27M4  [TSSOP14]  140.46,75.06 0 bottom
U$44Y1  TLC27M4  [TSSOP14]  157.48,46.23 180 bottom
U$44Z1  TLC27M4  [TSSOP14]  85.73,24.64 180 bottom
U$45  [CHIPLED_0805]  52.2,55.5 90 top
U$46  [CHIPLED_0805]  52.2,58.04 90 top
U$47  LM317  [TO263]  17.78,77.34 180 top
U$48  [DO-214AC]  12.32,95.76 0 top
U$49  [DO-214AC]  19.94,95.76 0 top
U$50  DIN6_CONNECTOR  [DIN6]  2.03,39.37 270 top
U$51  [DO-214AC]  42.8,22.61 270 top
U$52  [DO-214AC]  22.86,17.78 180 top
U$53  600R  [0603]  95.25,51.69 270 bottom
U$54  2SD1758  [TO252]  81.86,87.1 0 top
U$54X1  2SD1758  [TO252]  159.33,87.1 0 top
U$54Y1  2SD1758  [TO252]  138.61,34.19 180 top
U$54Z1  2SD1758  [TO252]  66.85,12.6 180 top
U$55  [TO252]  81.33,66.78 180 top
U$55X1  2SB1182  [TO252]  158.8,66.78 180 top
U$55Y1  2SB1182  [TO252]  139.14,54.51 0 top
U$55Z1  2SB1182  [TO252]  67.39,32.92 0 top
U$55Z2  HEADER_PIN  [PIN_.100]  110.49,29.21 0 top
U$55Z3  HEADER_PIN  [PIN_.100]  110.49,31.75 0 top
U$55Z4  HEADER_PIN  [PIN_.100]  110.49,21.59 0 top
U$55Z5  HEADER_PIN  [PIN_.100]  110.49,26.67 0 top
U$55Z6  HEADER_PIN  [PIN_.100]  113.03,24.13 0 top
U$55Z7  HEADER_PIN  [PIN_.100]  113.03,31.75 0 top
U$55Z8  HEADER_PIN  [PIN_.100]  113.03,21.59 0 top
U$55Z9  HEADER_PIN  [PIN_.100]  113.03,29.21 0 top
U$55Z10  HEADER_PIN  [PIN_.100]  113.03,26.67 0 top
U$55Z11  HEADER_PIN  [PIN_.100]  110.49,24.13 0 top
U$55Z12  HEADER_PIN  [PIN_.100]  64.39,54.61 0 top
U$55Z13  HEADER_PIN  [PIN_.100]  64.39,52.07 0 top
U$55Z14  HEADER_PIN  [PIN_.100]  64.39,49.53 90 top
U$55Z15  HEADER_PIN  [PIN_.100]  64.39,46.99 0 top
U$55Z16  HEADER_PIN  [PIN_.100]  124.71,61.47 90 top
U$55Z17  HEADER_PIN  [PIN_.100]  122.17,61.47 90 top
U$55Z18  HEADER_PIN  [PIN_.100]  127.25,61.47 90 top
U$55Z19  HEADER_PIN  [PIN_.100]  129.79,61.47 90 top
U$55Z20  LED  [CHIPLED_0805]  60.45,46.99 90 top
U$55Z21  LED  [CHIPLED_0805]  60.45,49.53 90 top
U$55Z22  LED  [CHIPLED_0805]  60.45,51.94 90 top
U$55Z23  LED  [CHIPLED_0805]  60.45,54.61 90 top
U$55Z24  LED  [CHIPLED_0805]  43.18,29.59 0 top
U$55Z25  LED  [CHIPLED_0805]  50.04,41.27 0 top
U$55Z26  LED  [CHIPLED_0805]  26.54,3.3 270 top
U$55Z27  LED  [CHIPLED_0805]  16.76,98.3 90 top
U$55Z28  HEADER_PIN  [PIN_.100]  76.2,42.55 0 top
U$55Z29  HEADER_PIN  [PIN_.100]  73.53,42.55 0 top
U$55Z30  HEADER_PIN  [PIN_.100]  76.2,45.72 0 bottom
U$56  [MSOP8]  112.65,55.37 180 top
U$57  [MSOP8]  111.76,46.23 180 top
U$58  [MSOP8]  114.81,68.2 0 top

## Tracks (layer width: path | path; a pad name or v marks a point on that pad's centre or on a via)
+3.3V  (via drill 0.38, 0.38 pad 0.89)
  Top 0.178: U$32.4 78.61,55.88 77.6,54.86 76.33,54.86 75.18,53.72 74.04,53.72 R35.2 74.04,53.59 v77.85,49.78 81.79,45.85 C47.1 | R37.2 51.44,52.96 v51.44,54.23 52.07,54.86 52.07,59.94 51.56,60.45 R38.2 | v81.66,52.07 R36.2 | v25.4,61.21 25.02,61.59 25.02,68.58 25.91,69.47 R6.1 | U$55Z25.A 50.04,40.26 45.59,40.26
  Top 0.254: 25.91,69.47 30.23,69.47 30.35,69.34 30.35,68.36 U$6.4 32.13,68.33 32.55,67.91 C71.1
  Top 0.61: 45.59,43.56 v47.12,43.56 47.24,43.56
  Route15 0.178: v117.48,37.47 117.48,37.72 | v25.4,61.21 25.53,60.96
  Bottom 0.178: 92.71,50.55 91.69,49.53 U$40.1 | 92.71,50.55 92.96,50.8 95.25,50.8 U$53.2 | v81.66,52.07 81.66,50.29 86.87,45.09 91.06,45.09 92.71,46.74 92.71,50.55
  Bottom 0.406: U$55Z9.2 115.95,29.21 117.6,30.86 117.6,37.34 v117.48,37.47
  pour Route15: 118.11,60.96 25.53,60.96 25.65,37.72 118.11,37.72
  pour Top: 29.97,39.24 45.59,39.24 45.59,47.88 29.97,47.88
  pour Route15: 25.53,58.04 25.53,74.17 35.05,74.17 35.05,58.04
+5V  (via drill 0.38, 0.38 pad 0.89)
  Top 0.178: U$58.1 113.92,66.04 113.92,64.39 C70.1 113.79,64.39 113.79,63.25 | U$56.1 113.67,57.53 113.67,59.44 C64.1 113.79,59.44 113.79,63.25 | 38.48,33.15 C45.1 38.35,33.15 | U$3.3 40,35.43 | 155.07,72.77 C40X1.1 155.07,72.64 | 156.72,72.77 U$55X1.3 156.84,72.77 | C40Y1.1 142.88,48.51 141.22,48.51 U$55Y1.3 141.1,48.51 R52Y1.2 139.7,48.51 | 77.6,72.77 C40.1 | 79.25,72.77 U$55.3 79.38,72.77 | 69.34,26.92 U$55Z1.3 69.47,26.92 | 71.12,26.92 C40Z1.1 71.12,27.05 | U$57.1 112.78,48.26 114.68,48.26 C67.1 114.68,48.13 120.9,48.13 U$28Y1.3 | 73.15,62.99 C32.1 | v37.08,68.58 38.35,68.58 U$12.1 | v91.06,35.94 92.08,36.96 R34.2 | 39.37,25.78 U$2.1 | 39.37,28.07 C2.1 | v72.01,62.99 73.15,62.99 | 73.15,62.99 U$31.1 | R52.2 80.77,72.77 | U$51.C | C2.1 39.37,28.45 | C2.1 39.37,28.57 | 113.79,63.25 v113.41,63.25 | R52X1.2 158.24,72.77 | 43.18,28.57 U$55Z24.A
  Top 0.508: 80.77,72.77 80.77,72.14 | U$27Y1.3 129.54,48.9 130.43,49.78 139.45,49.78 139.7,49.53 139.7,48.6 R52Y1.2
  Top 0.61: R52Z1.2 69.34,26.92 | 69.47,26.92 71.12,26.92 | 39.37,25.78 39.37,28.07 41.02,26.42 | 71.12,27.05 74.55,27.05 v75.95,28.45 | U$51.C 41.02,26.42 | 41.02,26.42 U$28Z1.3 U$27Z1.3 | 80.77,72.14 80.77,71.63 81.03,71.37 85.09,71.37 87,73.28 U$27.3 | 43.18,28.57 v41.4,28.57 39.37,28.57 38.23,28.57 37.85,28.96 37.85,31.75 38.48,32.38 38.48,33.11 C45.1 | 38.48,33.15 38.48,34.92 38.73,35.18 39.73,35.18 U$3.3
  Top 0.762: 79.25,72.77 77.6,72.77 | 79.38,72.77 R52.2 | 155.07,72.77 156.69,72.77 U$55X1.3 | 156.84,72.77 R52X1.2 | 155.07,72.64 151.64,72.64 v150.24,71.25 | 158.24,72.77 158.24,72.14 159,71.37 162.43,71.37 164.34,73.28 U$27X1.3 U$28X1.3
  Route15 0.178: v150.62,56.13 150.37,56.13
  Bottom 0.178: 167.77,76.07 R47X1.2 | 176.02,76.07 R48X1.2 | 58.42,23.62 R47Z1.2 | 50.17,23.62 R48Z1.2 | 140.34,69.98 139.7,69.34 C24X1.1 | 140.34,69.98 140.46,70.1 v140.46,70.87 U$44X1.4 | 140.34,69.98 141.1,69.22 R72X1.2 | 157.61,51.31 158.24,51.94 C24Y1.1 | 157.61,51.31 157.48,51.18 U$44Y1.4 | 157.61,51.31 156.84,52.07 R72Y1.2 156.72,52.07 155.96,52.83 155.96,54.1 153.92,56.13 v150.62,56.13 | 62.86,69.98 62.23,69.34 C24.1 | 62.86,69.98 62.99,70.1 U$44.4 | 62.86,69.98 63.63,69.22 R72.2 63.75,69.22 64.52,68.45 64.52,67.18 68.71,62.99 v72.01,62.99 | 85.85,29.72 86.49,30.35 C24Z1.1 | 85.85,29.72 85.73,29.59 v85.73,28.83 U$44Z1.4 | 85.85,29.72 85.09,30.48 R72Z1.2 | U$43X1.4 149.86,71.63 v150.24,71.25 151.26,70.23 C22X1.1 | U$43Y1.4 148.08,49.66 v147.7,50.04 146.69,51.05 C22Y1.1 | U$43Z1.4 76.33,28.07 v75.95,28.45 74.93,29.46 C22Z1.1 | U$43.4 72.39,71.63 v72.77,71.25 73.79,70.23 C22.1 | 90.3,76.07 R47.2 | 121.92,45.21 R48Y1.2 | 98.55,76.07 R48.2 | R47Y1.2 130.17,45.21
  Bottom 0.508: 90.3,76.07 90.3,73.91 U$27.3 | 98.55,76.07 98.55,74.17 U$28.3
  Bottom 0.61: 58.42,23.62 58.42,25.78 U$27Z1.3 | 50.17,23.62 50.17,25.53 U$28Z1.3 | 121.92,45.21 121.92,47.12 U$28Y1.3 | 130.17,45.21 130.17,47.37 U$27Y1.3
  Bottom 0.762: 167.77,76.07 167.77,73.91 U$27X1.3 | 176.02,76.07 176.02,74.17 U$28X1.3
  pour Route15: 33.4,36.07 33.4,27.43 150.37,27.56 150.37,74.42 36.58,74.3 36.58,62.99 121.03,62.99 121.03,36.07
+6V  (via drill 1.4)
  Top 1.016: U$50.3 12.19,39.37 14.48,41.66 19.94,41.66 v20.83,40.77
+6V_SW  (via drill 0.38 pad 0.89, 1.4)
  Top 0.178: 34.67,25.65 U$2.3 | 31.75,25.65 C44.1
  Top 1.016: 34.67,25.65 31.75,25.65 29.34,25.65 v28.7,25.02 | v25.91,40.77 24.13,40.77 23.49,40.13 23.49,29.46 C5.+
  Bottom 1.016: v28.7,25.02 19.05,25.02 C5.+
+33.75V  (via drill 0.38, 0.38 pad 0.89, 0.6 pad 0.89)
  Top 0.178: 17.78,88.14 C43.1 17.91,88.14 18.03,88.27 | 149.48,88.39 148.59,89.28 C42X1.1 | 149.48,88.39 149.73,88.14 149.73,87.76 U$26X1.8 | 149.35,32 148.21,33.15 148.21,33.53 U$26Y1.8 | 76.71,11.3 77.6,10.41 C42Z1.1 | 76.71,11.3 76.45,11.56 76.45,11.94 U$26Z1.8 | 72.01,88.39 71.12,89.28 C42.1 | 72.01,88.39 72.26,88.14 72.26,87.76 U$26.8 | 72.01,88.39 v72.26,88.65 | 76.71,11.3 v76.45,11.05 | v149.35,12.57 149.35,32 | 149.35,32 C42Y1.1 | 149.48,88.39 v149.73,88.65 | v17.91,92.33 18.03,92.2 | R39.2 18.03,89.92 | U$13Z1.4 116.71,4.83 | 34.16,94.87 32,94.87 U$13.4 | U$13X1.4 109.47,94.87 | U$13Y1.4 184.78,27.05 | U$55Z27.A 17.78,98.3 | U$49.C U$48.A
  Top 0.762: U$13Z1.4 121.34,4.77 v121.54,4.57 | v184.78,22.1 U$13Y1.4 | U$47.2 17.78,88.05 C43.1 | 18.03,88.27 18.03,89.88 R39.2 18.07,92.16 v17.91,92.33 U$49.C 17.91,97.53 17.78,97.66 17.78,98.26 U$55Z27.A
  Top 1.016: v27.05,94.87 34.16,94.87 | v104.78,95.12 109.27,95.12 U$13X1.4
  Route15 0.178: v149.35,12.57 149.35,12.32
  Bottom 0.178: C37Y1.1 178.05,33.53 174.88,33.53 v174.5,33.15 173.99,32.64 173.99,30.99 173.74,30.73 172.97,30.73 172.08,31.62 U$4Y1.4 | 104.78,11.94 103.25,11.94 102.62,11.3 102.49,11.3 102.23,11.05 102.23,9.4 101.98,9.14 101.22,9.14 100.33,10.03 U$4Z1.4 | 104.78,11.94 106.3,11.94 C37Z1.1 | v41.27,87.76 42.42,87.76 C37.1 | C37X1.1 v119.89,88.9 | v48.39,88.14 U$4.4 | v125.86,88.14 U$4X1.4 | 104.78,11.94 v104.78,11.68
  pour Route15 (isolate 0.406): 0.63,99.31 0.63,87.76 170.18,87.76 170.18,12.32 0.76,12.32 0.76,0.76 189.1,0.89 189.1,99.44
+36V  (via drill 1.4)
  Top 1.016: U$50.5 v20.82,46.87 v20.83,46.86
+36V_SW  (via drill 0.38, 1.4)
  Top 0.178: 12.83,86.36 C39.1 12.83,86.49 | U$47.3 15.24,85.72 | U$48.C 10.41,95.76
  Top 0.762: 15.24,85.72 14.61,85.72 v13.97,86.36 12.87,86.36 C39.1 | 12.83,86.49 11.18,86.49 10.54,87.12 10.54,95.51 U$48.C
  Top 1.016: C6.+ 17.02,52.83 18.8,51.05 24.89,51.05 25.91,50.04 25.91,46.99 v26.04,46.86
  pour Bottom (isolate 0.406): 18.8,48.9 0.51,48.9 0.51,99.44 18.8,99.44
-5V  (via drill 0.38, 0.38 pad 0.89)
  Top 0.178: C41Y1.2 134.87,40.26 | 136.53,40.26 U$54Y1.3 136.65,40.13 | 21.59,13.59 21.59,13.97 C1.2 | 19.18,11.18 U$1.3 19.05,11.18 | U$54X1.3 161.42,81.15 | U$54.3 83.95,81.15 | 64.77,18.67 U$54Z1.3 | C41Z1.2 63.12,18.67 | C41.2 85.6,81.15 | 163.07,81.15 C41X1.2 | 20.95,17.78 U$52.A | R77.1 33.15,3.3
  Top 0.61: 134.87,40.26 136.53,40.26 | 136.65,40.13 138.05,40.13 v138.68,39.5 | 64.77,18.67 63.12,18.67 v61.98,18.67 | 18.8,17.78 v18.67,17.65 | 19.05,11.18 17.78,11.18 17.14,10.54 17.14,5.21 20.32,2.03 32.89,2.03 33.27,2.41 33.27,3.26 R77.1
  Top 0.762: 161.42,81.15 163.07,81.15 v164.21,81.15 | 83.95,81.15 85.56,81.15 C41.2 86.7,81.11 v86.74,81.15
  Top 1.016: 19.18,11.18 21.59,13.59 | U$52.A 18.8,17.78 | 21.59,13.97 21.59,17.14 20.95,17.78
  Route15 0.178: v93.34,14.1 93.34,14.35 | v130.3,86.11 130.3,85.85 | 168.15,35.94 v168.4,35.94 | v55.63,86.11 55.63,85.85
  Bottom 0.178: C25X1.2 140.21,81.03 140.46,80.77 U$44X1.11 140.46,77.34 142.11,75.69 144.91,75.69 145.29,75.31 145.29,74.17 145.54,73.91 146.94,73.91 150.11,77.09 | C23X1.2 149.35,79.63 149.86,79.12 U$43X1.11 149.86,77.34 150.11,77.09 | 152.02,76.96 154.3,79.25 R51X1.1 | 152.02,76.96 150.24,76.96 150.11,77.09 | U$44.11 62.99,80.77 62.74,81.03 C25.2 62.74,81.15 61.98,81.92 61.98,82.17 59.56,84.58 57.15,84.58 v55.63,86.11 54.23,87.5 C36.2 | C23Y1.2 148.59,41.66 148.08,42.16 U$43Y1.11 148.08,43.94 147.32,44.7 145.8,44.7 143.38,42.29 143.38,42.04 R51Y1.1 143.26,42.04 143.26,40.77 141.99,39.5 | v138.68,39.5 141.99,39.5 | C23.2 71.88,79.63 72.39,79.12 U$43.11 72.39,77.34 72.77,76.96 74.55,76.96 v75.56,77.98 76.83,79.25 R51.1 | C23Z1.2 76.83,20.07 76.33,20.57 U$43Z1.11 76.33,22.35 75.95,22.73 74.17,22.73 | 74.17,22.73 71.88,20.45 R51Z1.1 | 157.73,40.26 157.48,40.51 U$44Y1.11 | 85.98,18.67 85.73,18.92 U$44Z1.11 | v93.34,14.1 93.34,13.34 94.49,12.19 C36Z1.2 | C36Y1.2 166.24,33.78 v165.1,33.78 163.19,33.78 162.69,33.27 144.53,33.27 141.99,35.81 141.99,39.5 | v130.3,86.11 131.7,87.5 C36X1.2 | v100.33,14.35 U$4Z1.11 | U$4.11 v48.39,85.34 | v168.4,35.94 170.94,35.94 171.45,36.45 171.45,36.58 172.08,37.21 U$4Y1.11 | U$4X1.11 v125.86,85.34 | 85.98,18.67 v87.12,18.67 | C25Z1.2 85.98,18.67 | 157.73,40.26 v158.88,40.26 | C25Y1.2 157.73,40.26 | 74.17,22.73 v74.17,23.11 | 152.02,76.96 v152.02,76.58
  pour Route15: 38.35,85.85 38.35,76.07 152.65,76.07 152.65,25.15 0.76,25.15 0.76,14.35 168.15,14.35 168.15,85.85
-6V  (via drill 1.4)
  Top 1.016: U$50.1 20.31,31.87 | 20.31,31.87 20.32,31.88 | 20.31,31.87 20.31,36.19 v20.83,36.7
-6V_SW  (via drill 1.4)
  Top 0.178: 22.86,8.26 C46.2
  Top 0.61: U$1.2 19.18,8.64 | 22.86,8.26 22.86,11.43 24.77,11.43 26.67,13.34 26.67,19.68 26.42,19.94 26.42,27.94
  Top 1.016: 22.86,8.26 19.56,8.26 19.18,8.64 | C4.- 26.42,27.94 25.91,27.94 | 25.91,27.94 v25.91,36.7 | 25.91,27.94 25.78,27.94
AGND  (via drill 0.38, 0.38 pad 0.89)
  Top 0.178: U$41Z1.A | 22.23,6.48 22.86,6.48 C46.1 22.86,6.6 | U$1.1 19.18,6.1 | U$51.A | U$42Z1.C 49.28,2.41 | C70.2 104.14,64.39 99.82,60.07 99.82,59.69 IC1.34 99.82,59.56 99.82,57.78 99.31,57.28 | 95,57.28 99.31,57.28 | 95,57.28 93.73,57.28 91.82,59.18 91.82,59.56 IC1.44 | 99.31,57.28 99.31,53.09 100.97,51.44 102.36,51.44 IC1.24 | C41Y1.1 134.87,41.91 | 137.92,41.91 R53Y1.1 138.05,42.04 138.05,42.8 138.56,43.31 138.56,44.2 139.83,45.47 140.21,45.47 U$29Y1.3 140.34,45.59 141.6,46.86 142.88,46.86 | 152.78,40.64 U$17Y1.2 152.65,40.51 150.62,38.48 | 152.78,43.81 U$16Y1.2 152.65,43.94 150.11,43.94 149.61,44.45 149.61,46.23 v145.8,50.04 | 148.21,35.31 148.21,35.43 U$26Y1.5 | 148.21,35.31 148.21,34.92 U$26Y1.6 | 148.21,35.31 151,32.51 151,32 C42Y1.2 | U$26Y1.5 148.21,35.31 | 147.83,35.81 148.08,35.56 U$26Y1.5 | 147.83,35.81 146.56,37.08 145.16,37.08 R41Y1.1 | 150.62,38.48 147.95,35.81 147.83,35.81 | 142.88,46.86 142.88,46.23 150.62,38.48 | 142.88,46.86 C40Y1.2 | U$26X1.5 149.86,85.85 149.86,86.36 U$26X1.6 | C42X1.2 146.94,89.28 146.94,88.65 149.73,85.85 U$26X1.5 | U$26X1.5 149.86,85.72 151.38,84.2 152.78,84.2 R41X1.1 152.78,76.71 153.67,75.82 | 160.02,79.38 R53X1.1 159.89,79.25 159.89,78.49 158.62,77.22 158.62,76.33 158.11,75.82 157.73,75.82 U$29X1.3 157.61,75.69 156.34,74.42 155.07,74.42 | 163.07,79.38 C41X1.1 | 153.67,75.82 155.07,74.42 | 155.07,74.42 C40X1.2 | 81.03,19.05 U$17Z1.2 80.9,18.92 76.2,14.22 76.07,14.22 | 81.03,22.23 U$16Z1.2 80.53,22.34 v80.14,22.86 | 76.45,13.72 76.45,13.84 U$26Z1.5 | 76.45,13.72 76.45,13.34 U$26Z1.6 | 76.45,13.72 79.25,10.92 79.25,10.41 C42Z1.2 | U$26Z1.5 76.45,13.72
  Top 0.178: 76.07,14.22 76.33,13.97 U$26Z1.5 | 76.07,14.22 74.8,15.49 73.41,15.49 R41Z1.1 73.41,22.99 71.12,25.27 C40Z1.2 | 26.29,85.72 R50.1 26.16,85.72 | C38.2 26.29,87.76 | C43.2 16.26,88.14 | 35.56,35.43 U$3.1 35.43,35.56 | 34.54,56.13 31.88,56.13 C10.2 | 34.54,56.13 34.54,56.52 U$5.10 34.54,56.64 34.54,57.02 U$5.9 34.67,57.15 35.56,57.15 36.83,58.42 v36.83,59.56 | 34.54,56.13 U$5.11 | U$5.47 36.83,62.87 36.45,62.87 U$5.48 36.45,62.74 36.45,61.21 37.97,59.69 | v36.83,59.56 37.85,59.56 37.97,59.69 | v36.83,59.56 34.67,59.56 U$5.4 | 37.97,59.69 39.37,61.09 39.37,62.74 U$5.42 39.37,62.87 39.75,62.87 U$5.41 | C64.2 115.44,59.44 115.44,61.72 117.6,63.88 117.6,72.52 C68.2 122.68,72.52 v123.32,73.15 | C41.1 85.6,79.38 v84.07,79.38 82.55,79.38 R53.1 82.42,79.25 82.42,78.49 81.15,77.22 81.15,76.33 80.65,75.82 80.26,75.82 U$29.3 80.14,75.69 78.87,74.42 77.6,74.42 C40.2 | R23X1.2 140.21,86.11 v140.21,84.33 140.21,82.55 U$36X1.2 140.21,82.42 141.86,82.42 144.27,80.01 | 144.27,80.01 144.91,80.64 145.16,80.64 U$17X1.2 | 144.27,80.01 142.88,78.61 142.88,78.11 143.51,77.47 145.16,77.47 U$16X1.2 | U$41X1.A | U$42X1.C 176.91,97.28 | U$41.A | 99.44,97.28 U$42.C | U$42Y1.C 121.03,24 | U$41Y1.A | 79.12,50.42 81.79,47.75 C47.2 | 79.12,50.42 76.58,52.96 76.58,53.34 U$32.2 | U$26.5 72.39,85.85 72.39,86.36 U$26.6 | 73.66,84.45 72.39,85.72 U$26.5 | 73.66,84.45 73.91,84.2 75.31,84.2 R41.1 | C42.2 69.47,89.28 69.47,88.65 72.26,85.85 U$26.5 | 39.88,68.58 41.27,68.58 | 41.27,68.58 42.8,68.58 C13.2 | 41.27,68.58 C14.2 | 39.88,68.58 39.12,69.34 36.83,69.34 v36.07,70.1 35.43,70.74 35.43,71.37 36.07,72.01 U$9.2 | 39.88,68.58 C16.2
  Top 0.178: 72.26,60.96 72.39,60.83 72.39,60.45 73.15,59.69 C32.2 | 72.26,60.96 69.6,63.63 69.09,63.63 U$31.7 | 67.06,60.96 72.26,60.96 | IC1.60 86.87,49.02 87.25,49.02 v88.77,50.55 89.66,51.44 89.66,54.61 88.9,55.37 86.87,55.37 IC1.52 | 113.03,50.29 112.9,50.42 112.9,53.21 U$56.7 | 113.03,50.29 114.55,50.29 115.32,51.05 C63.2 120.14,51.05 122.81,48.39 122.81,46.48 | 113.03,50.29 110.62,50.29 109.86,51.05 C62.2 | C1.1 23.62,13.97 | C66.2 112.65,41.91 112.14,42.42 112.14,44.07 U$57.7 112.14,44.2 112.14,44.7 113.92,46.48 114.68,46.48 | 45.59,63.88 45.59,65.02 C15.2 | 45.59,63.88 45.59,63.25 C7.2 45.47,63.25 45.47,62.87 43.69,61.09 U$5.36 43.69,60.96 43.69,60.58 U$5.35 | v33.15,65.15 34.29,65.15 C12.2 | C11.2 40.77,50.42 v40.77,52.07 40.77,53.72 U$5.22 40.89,53.85 41.27,53.85 U$5.23 | 112.27,72.52 112.27,70.74 113.54,69.47 114.17,69.47 114.43,69.72 114.43,70.23 U$58.7 | 68.58,24 U$29Z1.3 68.45,23.88 68.07,23.88 66.8,22.61 66.8,20.95 66.29,20.45 R53Z1.1 66.17,20.32 | 63.63,20.32 63.12,20.32 C41Z1.1 | R23.2 62.74,86.11 62.74,82.55 U$36.2 62.74,82.42 64.9,82.42 67.18,80.14 | 157.73,36.58 157.73,35.18 R23Y1.2 | 157.73,36.58 v157.73,36.96 157.73,38.73 U$36Y1.2 | 85.98,14.99 85.98,13.59 R23Z1.2 | 85.98,14.99 v85.98,15.37 85.98,17.14 U$36Z1.2 | R1.1 29.97,60.07 29.97,62.1 C8.2 v28.7,62.1 | 67.18,80.14 67.18,78.87 67.69,78.36 67.69,77.47 U$16.2 | 67.18,80.14 67.69,80.64 U$17.2 67.82,80.77 69.98,80.77 | C6.- 20.83,56.77 C9.2 | 9.14,78.99 9.14,79.25 R8.1 9.27,79.25 | U$10.SHIELD1 3.81,73.66 | v68.58,66.8 67.06,66.8 C30.2 | 108.84,41.53 108.84,42.16 C65.2 | 108.84,41.53 99.57,41.53 99.06,42.04 99.06,43.94 IC1.14
  Top 0.178: v95.63,36.7 95.5,36.83 94.36,36.83 U$30.2 | 69.98,80.77 70.1,80.77 v70.74,81.41 | 85.98,14.99 v94.49,14.99 | 157.73,36.58 v166.24,36.58 | 112.27,72.52 112.27,79.12 117.98,84.84 v119.89,84.84 | 112.27,72.52 C69.2 | 45.59,63.88 59.44,63.88 61.72,66.17 | 122.81,46.48 123.06,46.48 v124.97,44.58 | 114.68,46.48 122.81,46.48 | 114.68,46.48 C67.2 | 67.06,60.96 61.85,66.17 61.72,66.17 | 67.06,60.96 C31.2 | 61.72,66.17 v61.98,66.42 | 69.98,80.77 73.66,84.45 | 79.12,50.42 v78.99,50.29 | 153.67,75.82 149.48,71.63 149.48,70.99 149.99,70.48 151.38,70.48 v152.15,71.25 | v95,56.26 95,57.28 | 36.7,33.15 C45.2 | 108.84,41.53 108.84,35.94 U$55Z7.2 | R75.1 50.17,46.61 55.37,46.61 55.75,46.99 R55.1 55.88,46.99 | 55.88,46.99 58.67,44.2 60.33,44.2 61.21,45.09 R54.1 | 55.88,46.99 55.88,49.4 | 55.88,49.4 55.88,51.94 R73.1 | 55.88,49.4 R56.1 | 11.56,98.3 R74.1 | C39.2 12.83,88.14 | R76.1 44.83,35.43 | 25.4,3.3 U$55Z26.A | 26.16,6.6 26.16,6.99 | 24.13,17.14 24.77,17.78 U$52.C 24.13,17.14
  Top 0.254: C71.2 34.25,65.15 C12.2 | U$6.2 28.11,66.59 28.45,66.93 31.24,66.93 31.37,66.8 31.37,66.17 32,65.53 32.77,65.53 v33.15,65.15
  Top 0.61: 40.26,20.57 U$51.A | 134.87,41.91 137.92,41.91 | 71.12,25.27 69.85,25.27 68.58,24 | 66.17,20.32 63.63,20.32 v63.63,22.99 | C42Y1.2 151.09,30.9 v151.13,30.86 | 25.4,3.3 24.51,3.3 22.99,4.83 22.99,6.39 | C45.2 36.7,33.11 | 36.7,33.15 36.7,34.92 36.45,35.18 35.81,35.18 U$3.1 | C4.+ 28.83,31.75 32,34.92 32,35.18 | 32,35.18 C3.2 | 35.43,35.56 32.38,35.56 32,35.18 | 37.08,18.41 37.47,18.03 37.47,17.91 36.7,17.14 36.7,18.16 36.32,18.54 35.18,18.54 34.8,18.16 | 35.18,18.16 36.32,19.3 36.32,19.43 36.58,19.68 37.72,19.68 38.35,19.05 38.35,17.27 37.34,16.26 | U$2.4 37.34,18.11 | v41.02,32.64 40.39,32.64 39.37,31.62 C2.2 | 46.86,35.43 v46.86,34.16 | R76.1 46.86,35.43 | 46.86,35.43 47.88,35.43 52.7,40.26 52.7,43.05 55.75,46.1 55.75,46.95 R55.1
  Top 0.762: 49.28,2.41 U$41Z1.A | 160.02,79.38 163.07,79.38 | U$41X1.A v172.59,97.28 176.79,97.28 U$42X1.C | 11.56,98.3 11.56,97.79 12.32,97.03 12.32,88.61 C39.2 14.48,89.75 v14.48,89.79 | 12.83,88.14 C43.2 | R50.1 C38.2 | 26.29,87.76 27.69,87.76 v27.81,87.88 | 9.14,78.99 9.14,75.06 7.62,73.53 3.86,73.53 U$10.SHIELD1
  Top 1.016: 22.23,6.48 19.56,6.48 19.18,6.1 | 31.75,22.61 C44.2 | 49.28,2.41 37.97,13.72 | 99.44,97.28 v95.12,97.28 U$41.A | U$41Y1.A v125.35,24 121.03,24 | 23.62,13.97 23.62,16.64 24.13,17.14 24.13,19.68 23.37,20.45 16.26,20.45 C5.- | 22.86,6.6 26.16,6.6 27.81,6.6 30.61,9.4 30.61,11.99 U$2.4 | C46.1 22.99,6.39 | 37.08,18.41 v37.08,25.53 | 35.18,18.16 34.8,18.16 | 37.34,18.11 37.34,16.26 | 26.16,6.73 26.16,6.99 26.16,7.75
  Bottom 0.178: 75.06,27.3 74.42,27.3 U$43Z1.1 74.42,28.57 74.17,28.83 74.17,30.35 74.93,31.11 C22Z1.2 74.93,31.24 76.45,32.77 C54Z1.2 | 75.69,27.3 75.06,27.3 | 75.06,27.3 U$43Z1.2 | C25Z1.1 v85.98,15.37 85.98,13.59 86.87,12.7 C59Z1.2 86.87,12.57 86.36,12.06 | 86.36,12.06 84.33,12.06 83.57,12.83 C56Z1.2 83.44,12.83 81.53,14.73 | 86.36,12.06 93.47,4.95 99.19,4.95 101.09,6.86 R9Z1.1 | 81.53,14.73 81.15,15.11 C50Z1.2 | 82.93,17.65 82.8,17.78 79.5,17.78 78.99,18.29 76.83,18.29 C23Z1.1 | 82.93,17.65 82.93,16.13 81.53,14.73 | 82.93,17.65 82.93,19.43 81.41,20.95 C51Z1.2 81.28,20.95 81.03,21.21 81.03,25.4 80.65,25.78 76.83,25.78 75.69,26.92 75.69,27.3 | 75.69,27.3 U$43Z1.3 | 61.98,86.87 61.85,87 C59.2 | 61.98,86.87 62.74,86.11 C25.1 | C50.2 67.56,84.58 65.28,86.87 C56.2 65.15,86.87 64.39,87.63 62.74,87.63 61.98,86.87 | C59.2 61.98,86.87 | 56.39,75.06 57.15,75.82 U$33.A | 56.39,75.06 56.01,74.68 56.01,72.77 R28.2 | 55.63,75.82 56.39,75.06 | 55.63,75.82 54.74,76.71 52.96,76.71 51.18,78.49 R22.2 | 46.74,92.08 47.5,92.84 R9.1 | 46.74,92.08 46.48,91.82 46.48,88.65 v45.21,87.38 43.94,86.11 42.42,86.11 C37.2 42.42,85.98 41.66,85.22 41.66,77.34 44.83,74.17 R26.1 44.83,74.04 45.21,74.04 46.36,72.9 48.13,72.9 48.64,73.41 48.64,73.66 U$24.4 48.64,73.79 50.55,75.69 51.82,75.69 52.07,75.44 52.96,75.44 53.47,74.93 54.74,74.93 55.63,75.82 | 50.55,88.39 50.29,88.65 50.29,91.19 49.4,92.08 46.74,92.08 | 50.55,88.39 52.96,85.98 54.23,85.98 C36.1 | 50.55,88.39 54.86,88.39 56.13,87.12 61.85,87.12 C59.2 | C25Y1.1 v157.73,36.96 157.73,35.18 158.62,34.29 C59Y1.2 158.62,34.16 158.11,33.66 156.08,33.66 155.32,34.42 C56Y1.2 155.19,34.42 153.29,36.32